# EAGLE schematic ADCS (EAGLE 9.6.0)

## Sheet 1 of 10: SMC
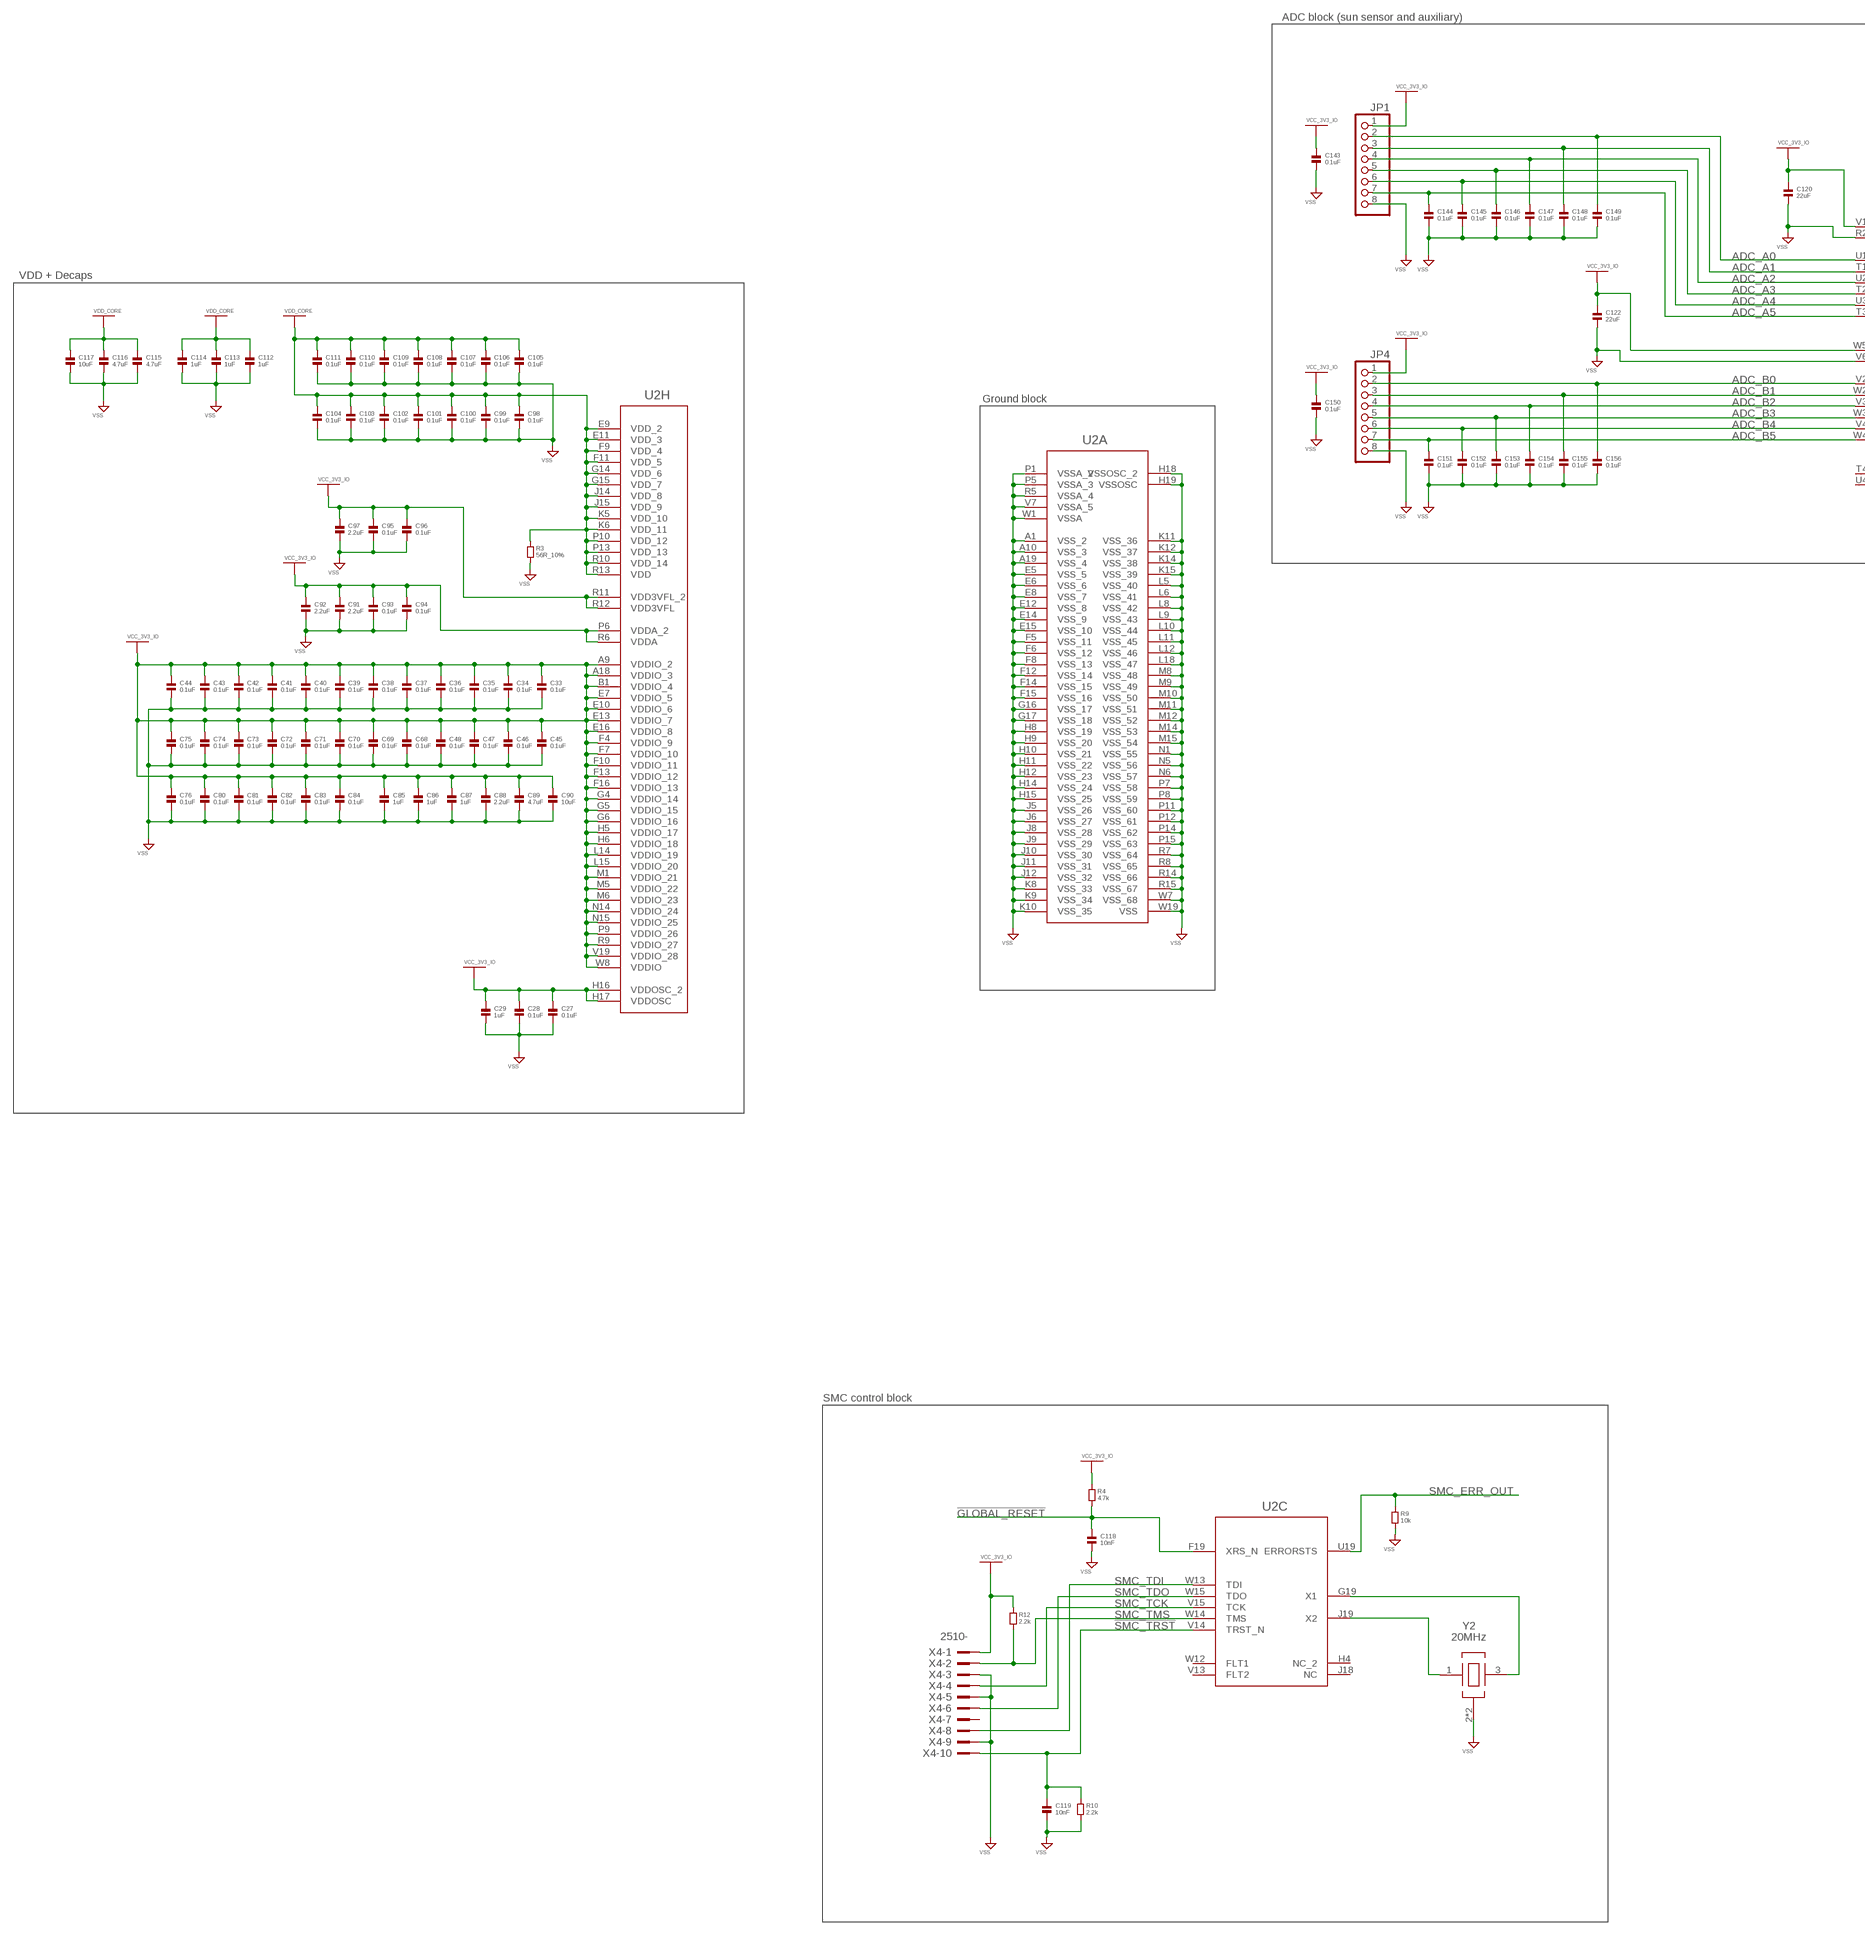
[diagram p0: schematic, sheet 1, part 1 of 2]
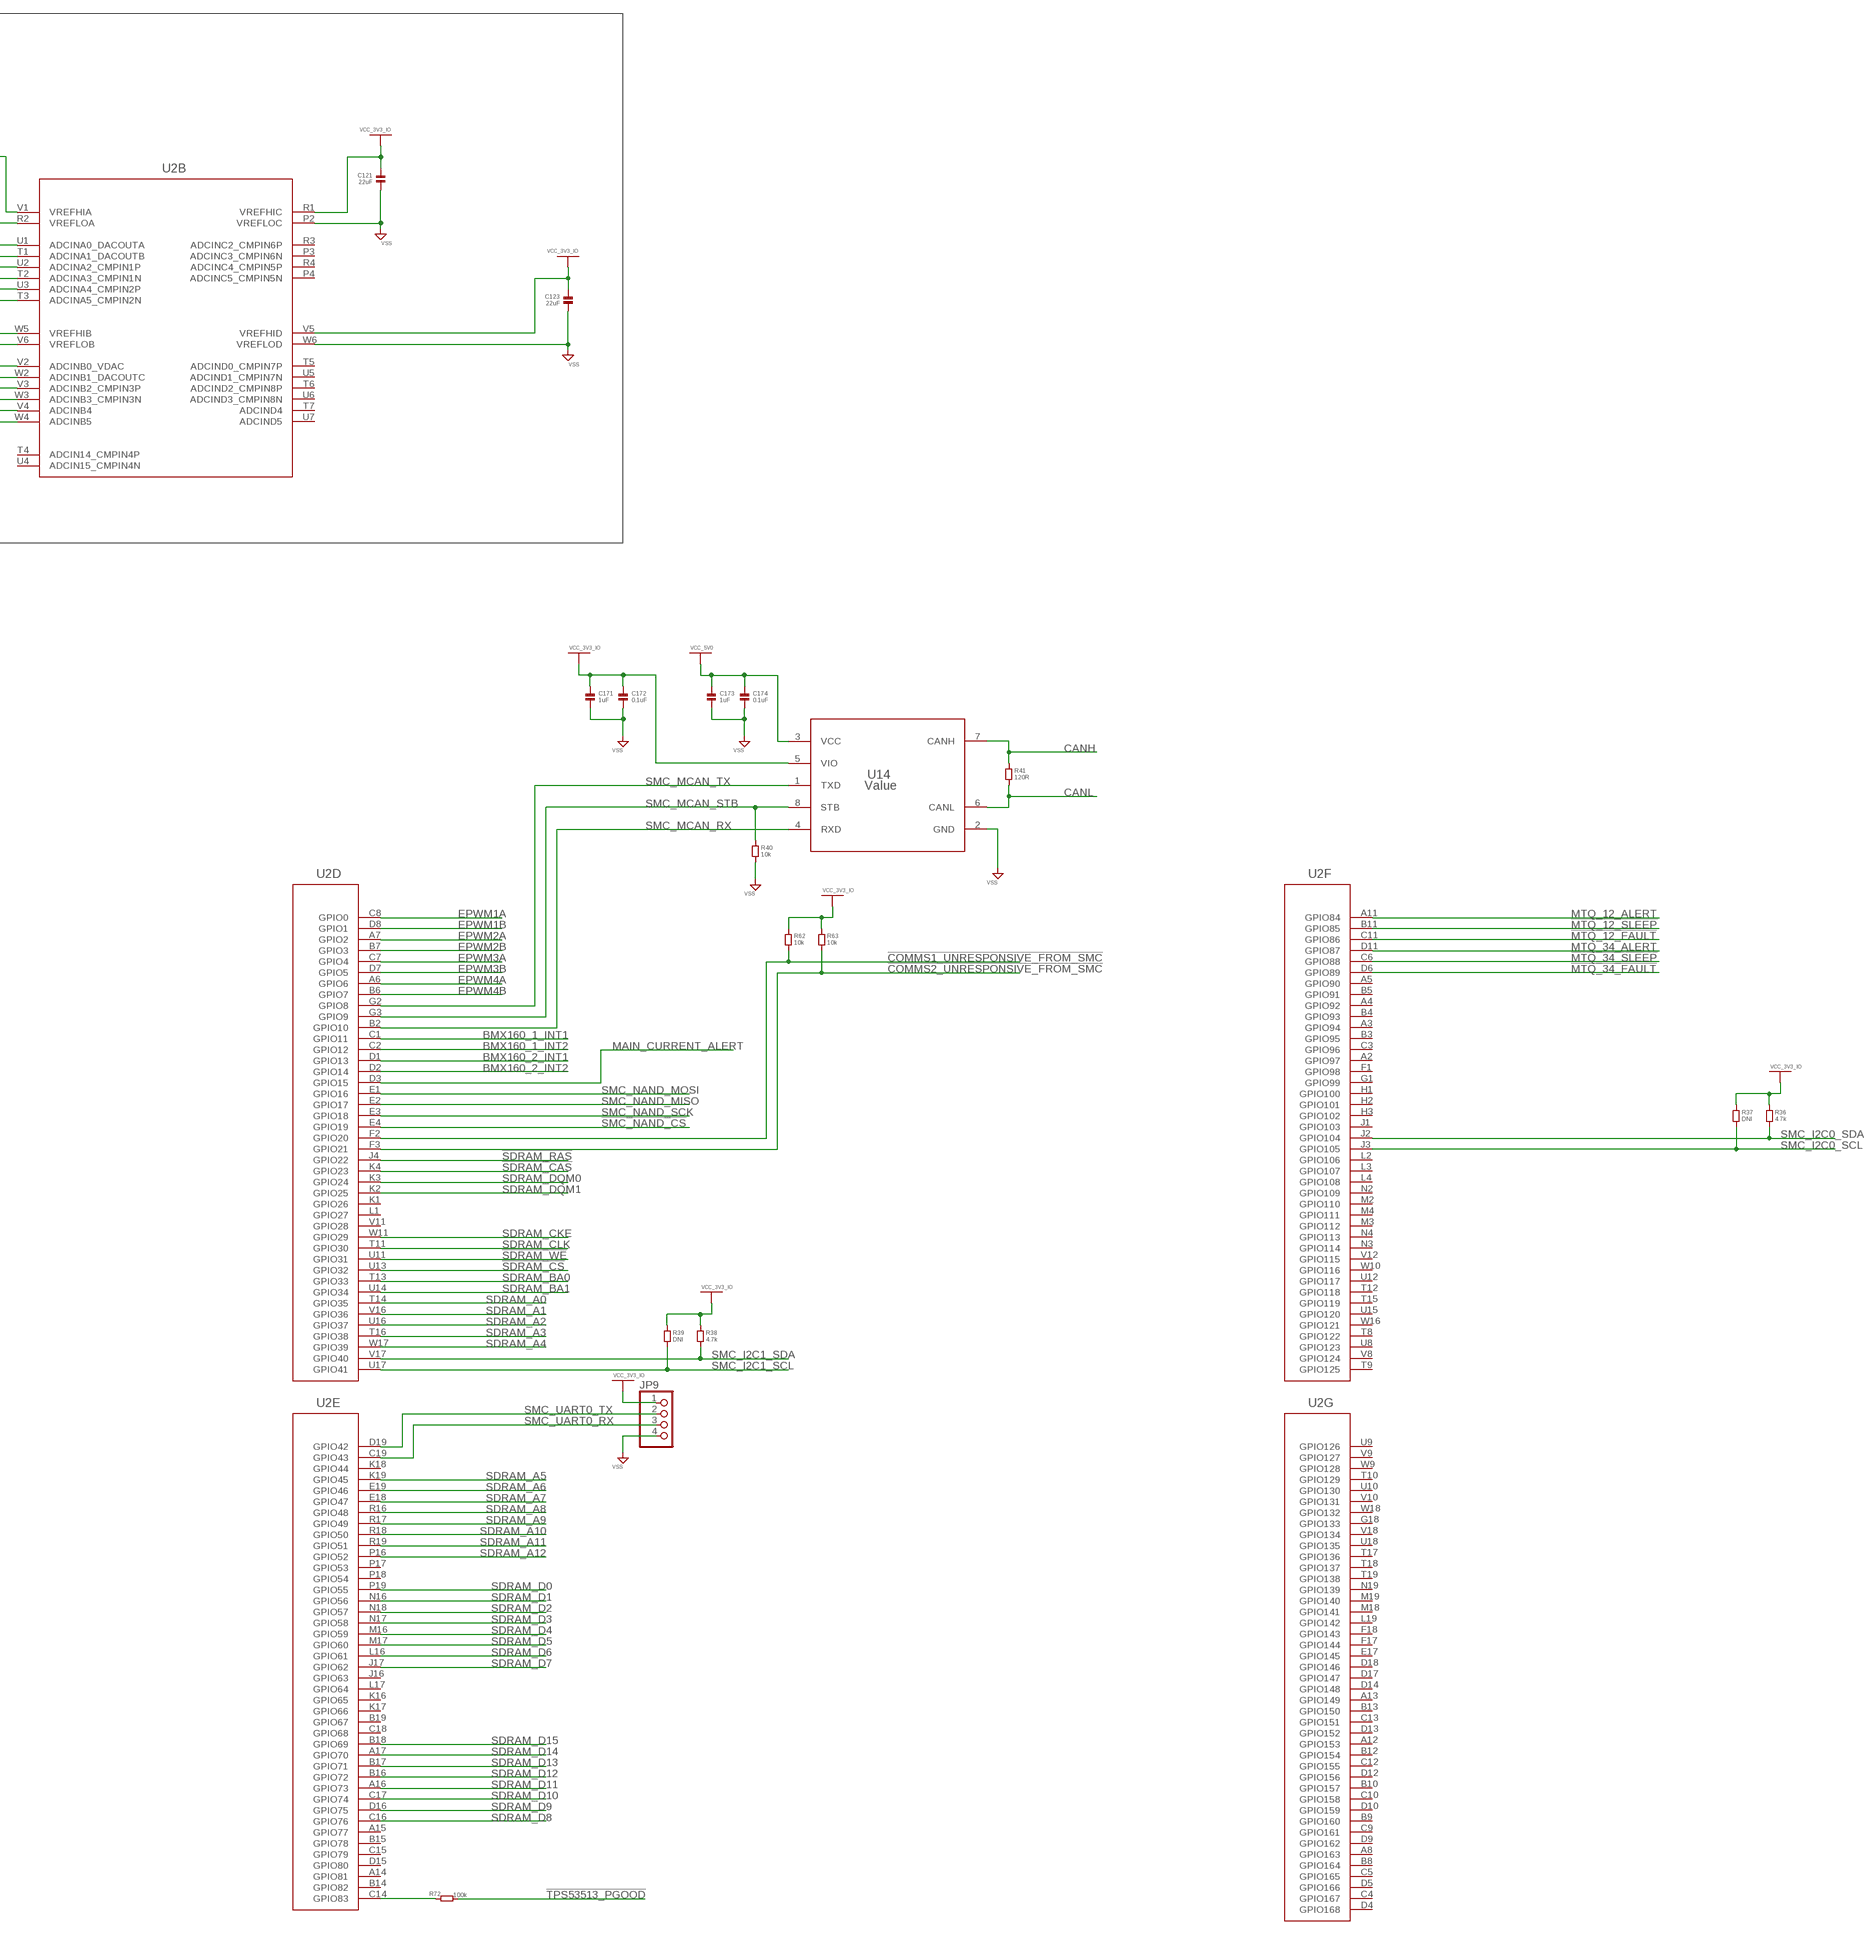
[diagram p1: schematic, sheet 1, part 2 of 2]

### Parts
C27  0.1uF  CAPACITOR.0402  [0402]
C28  0.1uF  CAPACITOR.0402  [0402]
C29  1uF  CAPACITOR.0402  [0402]
C33  0.1uF  CAPACITOR.0402  [0402]
C34  0.1uF  CAPACITOR.0402  [0402]
C35  0.1uF  CAPACITOR.0402  [0402]
C36  0.1uF  CAPACITOR.0402  [0402]
C37  0.1uF  CAPACITOR.0402  [0402]
C38  0.1uF  CAPACITOR.0402  [0402]
C39  0.1uF  CAPACITOR.0402  [0402]
C40  0.1uF  CAPACITOR.0402  [0402]
C41  0.1uF  CAPACITOR.0402  [0402]
C42  0.1uF  CAPACITOR.0402  [0402]
C43  0.1uF  CAPACITOR.0402  [0402]
C44  0.1uF  CAPACITOR.0402  [0402]
C45  0.1uF  CAPACITOR.0402  [0402]
C46  0.1uF  CAPACITOR.0402  [0402]
C47  0.1uF  CAPACITOR.0402  [0402]
C48  0.1uF  CAPACITOR.0402  [0402]
C68  0.1uF  CAPACITOR.0402  [0402]
C69  0.1uF  CAPACITOR.0402  [0402]
C70  0.1uF  CAPACITOR.0402  [0402]
C71  0.1uF  CAPACITOR.0402  [0402]
C72  0.1uF  CAPACITOR.0402  [0402]
C73  0.1uF  CAPACITOR.0402  [0402]
C74  0.1uF  CAPACITOR.0402  [0402]
C75  0.1uF  CAPACITOR.0402  [0402]
C76  0.1uF  CAPACITOR.0402  [0402]
C80  0.1uF  CAPACITOR.0402  [0402]
C81  0.1uF  CAPACITOR.0402  [0402]
C82  0.1uF  CAPACITOR.0402  [0402]
C83  0.1uF  CAPACITOR.0402  [0402]
C84  0.1uF  CAPACITOR.0402  [0402]
C85  1uF  CAPACITOR.0402  [0402]
C86  1uF  CAPACITOR.0402  [0402]
C87  1uF  CAPACITOR.0402  [0402]
C88  2.2uF  CAPACITOR.0402  [0402]
C89  4.7uF  CAPACITOR.0603  [0603]
C90  10uF  CAPACITOR.0603  [0603]
C91  2.2uF  CAPACITOR.0402  [0402]
C92  2.2uF  CAPACITOR.0402  [0402]
C93  0.1uF  CAPACITOR.0402  [0402]
C94  0.1uF  CAPACITOR.0402  [0402]
C95  0.1uF  CAPACITOR.0402  [0402]
C96  0.1uF  CAPACITOR.0402  [0402]
C97  2.2uF  CAPACITOR.0402  [0402]
C98  0.1uF  CAPACITOR.0402  [0402]
C99  0.1uF  CAPACITOR.0402  [0402]
C100  0.1uF  CAPACITOR.0402  [0402]
C101  0.1uF  CAPACITOR.0402  [0402]
C102  0.1uF  CAPACITOR.0402  [0402]
C103  0.1uF  CAPACITOR.0402  [0402]
C104  0.1uF  CAPACITOR.0402  [0402]
C105  0.1uF  CAPACITOR.0402  [0402]
C106  0.1uF  CAPACITOR.0402  [0402]
C107  0.1uF  CAPACITOR.0402  [0402]
C108  0.1uF  CAPACITOR.0402  [0402]
C109  0.1uF  CAPACITOR.0402  [0402]
C110  0.1uF  CAPACITOR.0402  [0402]
C111  0.1uF  CAPACITOR.0402  [0402]
C112  1uF  CAPACITOR.0402  [0402]
C113  1uF  CAPACITOR.0402  [0402]
C114  1uF  CAPACITOR.0402  [0402]
C115  4.7uF  CAPACITOR.0603  [0603]
C116  4.7uF  CAPACITOR.0603  [0603]
C117  10uF  CAPACITOR.0603  [0603]
C118  10nF  CAPACITOR.0603  [0603]
C119  10nF  CAPACITOR.0603  [0603]
C120  22uF  CAPACITOR.0603  [0603]
C121  22uF  CAPACITOR.0603  [0603]
C122  22uF  CAPACITOR.0603  [0603]
C123  22uF  CAPACITOR.0603  [0603]
C143  0.1uF  CAPACITOR.0603  [0603]
C144  0.1uF  CAPACITOR.0603  [0603]
C145  0.1uF  CAPACITOR.0603  [0603]
C146  0.1uF  CAPACITOR.0603  [0603]
C147  0.1uF  CAPACITOR.0603  [0603]
C148  0.1uF  CAPACITOR.0603  [0603]
C149  0.1uF  CAPACITOR.0603  [0603]
C150  0.1uF  CAPACITOR.0603  [0603]
C151  0.1uF  CAPACITOR.0603  [0603]
C152  0.1uF  CAPACITOR.0603  [0603]
C153  0.1uF  CAPACITOR.0603  [0603]
C154  0.1uF  CAPACITOR.0603  [0603]
C155  0.1uF  CAPACITOR.0603  [0603]
C156  0.1uF  CAPACITOR.0603  [0603]
C171  1uF  CAPACITOR.0603  [0603]
C172  0.1uF  CAPACITOR.0603  [0603]
C173  1uF  CAPACITOR.0603  [0603]
C174  0.1uF  CAPACITOR.0603  [0603]
JP1  PINHD-1X8  [1X08]
JP4  PINHD-1X8  [1X08]
JP9  PINHD-1X4  [1X04]
R3  56R_10%  RESISTOR.0402  [0402]
R4  4.7k  RESISTOR.0603  [0603]
R9  10k  RESISTOR.0603  [0603]
R10  2.2k  RESISTOR.0603  [0603]
R12  2.2k  RESISTOR.0603  [0603]
R36  4.7k  RESISTOR.0603  [0603]
R37  DNI  RESISTOR.0603  [0603]
R38  4.7k  RESISTOR.0603  [0603]
R39  DNI  RESISTOR.0603  [0603]
R40  10k  RESISTOR.0603  [0603]
R41  120R  RESISTOR.0603  [0603]
R62  10k  RESISTOR.0603  [0603]
R63  10k  RESISTOR.0603  [0603]
R72  100k  RESISTOR.0603  [0603]
U2  Value  TEXAS_INSTRUMENTS-MICROCONTROLLER-TMS320F28386DZWTQ  [ZWT0337A-IPC_A]
U14  Value  TEXAS_INSTRUMENTS-CAN_TRANSCEIVER-TCAN1042VDRQ1  [TEXAS_INSTRUMENTS-CAN_TRANSCEIVER-TCAN1042/LED_DRIVER-TLC59731DR]
X4  2510-  [PAK100/2500-10]
Y2  20MHz  ESC-OSCILLATOR-ECS_200_9_33B_CTP_TR  [ESC-OSCILLATOR-ECS_200_9_33B_CTP_TR]

### Nets
!COMMS1_UNRESPONSIVE_FROM_SMC: R62.2 U2.F2(D:GPIO20) ; also sheet 4
!COMMS2_UNRESPONSIVE_FROM_SMC: R63.2 U2.F3(D:GPIO21) ; also sheet 4
!GLOBAL_RESET: C118.1 R4.2 U2.F19(C:XRS_N) ; also sheet 4,6,7
!MTQ_12_FAULT: U2.C11(F:GPIO86) ; also sheet 3
!MTQ_12_SLEEP: U2.B11(F:GPIO85) ; also sheet 3
!MTQ_34_FAULT: U2.D6(F:GPIO89) ; also sheet 3
!MTQ_34_SLEEP: U2.C6(F:GPIO88) ; also sheet 3
!SDRAM_CAS: U2.K4(D:GPIO23) ; also sheet 2
!SDRAM_CS: U2.U13(D:GPIO32) ; also sheet 2
!SDRAM_RAS: U2.J4(D:GPIO22) ; also sheet 2
!SDRAM_WE: U2.U11(D:GPIO31) ; also sheet 2
!SMC_NAND_CS: U2.E4(D:GPIO19) ; also sheet 2
!SMC_TRST: C119.1 R10.1 U2.V14(C:TRST_N) X4.10
!TPS53513_PGOOD: R72.2 ; also sheet 4,9
ADC_A0: C149.1 JP1.2 U2.U1(B:ADCINA0_DACOUTA)
ADC_A1: C148.1 JP1.3 U2.T1(B:ADCINA1_DACOUTB)
ADC_A2: C147.1 JP1.4 U2.U2(B:ADCINA2_CMPIN1P)
ADC_A3: C146.1 JP1.5 U2.T2(B:ADCINA3_CMPIN1N)
ADC_A4: C145.1 JP1.6 U2.U3(B:ADCINA4_CMPIN2P)
ADC_A5: C144.1 JP1.7 U2.T3(B:ADCINA5_CMPIN2N)
ADC_B0: C156.1 JP4.2 U2.V2(B:ADCINB0_VDAC)
ADC_B1: C155.1 JP4.3 U2.W2(B:ADCINB1_DACOUTC)
ADC_B2: C154.1 JP4.4 U2.V3(B:ADCINB2_CMPIN3P)
ADC_B3: C153.1 JP4.5 U2.W3(B:ADCINB3_CMPIN3N)
ADC_B4: C152.1 JP4.6 U2.V4(B:ADCINB4)
ADC_B5: C151.1 JP4.7 U2.W4(B:ADCINB5)
BMX160_1_INT1: U2.C1(D:GPIO11) ; also sheet 5
BMX160_1_INT2: U2.C2(D:GPIO12) ; also sheet 5
BMX160_2_INT1: U2.D1(D:GPIO13) ; also sheet 5
BMX160_2_INT2: U2.D2(D:GPIO14) ; also sheet 5
CANH: R41.1 U14.7(CANH) ; also sheet 6,7,10
CANL: R41.2 U14.6(CANL) ; also sheet 6,7,10
EPWM1A: U2.C8(D:GPIO0) ; also sheet 3
EPWM1B: U2.D8(D:GPIO1) ; also sheet 3
EPWM2A: U2.A7(D:GPIO2) ; also sheet 3
EPWM2B: U2.B7(D:GPIO3) ; also sheet 3
EPWM3A: U2.C7(D:GPIO4) ; also sheet 3
EPWM3B: U2.D7(D:GPIO5) ; also sheet 3
EPWM4A: U2.A6(D:GPIO6) ; also sheet 3
EPWM4B: U2.B6(D:GPIO7) ; also sheet 3
MAIN_CURRENT_ALERT: U2.D3(D:GPIO15) ; also sheet 9
MTQ_12_ALERT: U2.A11(F:GPIO84) ; also sheet 3
MTQ_34_ALERT: U2.D11(F:GPIO87) ; also sheet 3
N$1: U2.J19(C:X2) Y2.1(XI)
N$8: U2.G19(C:X1) Y2.3(XO)
N$44: R72.1 U2.C14(E:GPIO83)
SDRAM_A0: U2.T14(D:GPIO35) ; also sheet 2
SDRAM_A1: U2.V16(D:GPIO36) ; also sheet 2
SDRAM_A2: U2.U16(D:GPIO37) ; also sheet 2
SDRAM_A3: U2.T16(D:GPIO38) ; also sheet 2
SDRAM_A4: U2.W17(D:GPIO39) ; also sheet 2
SDRAM_A5: U2.K19(E:GPIO45) ; also sheet 2
SDRAM_A6: U2.E19(E:GPIO46) ; also sheet 2
SDRAM_A7: U2.E18(E:GPIO47) ; also sheet 2
SDRAM_A8: U2.R16(E:GPIO48) ; also sheet 2
SDRAM_A9: U2.R17(E:GPIO49) ; also sheet 2
SDRAM_A10: U2.R18(E:GPIO50) ; also sheet 2
SDRAM_A11: U2.R19(E:GPIO51) ; also sheet 2
SDRAM_A12: U2.P16(E:GPIO52) ; also sheet 2
SDRAM_BA0: U2.T13(D:GPIO33) ; also sheet 2
SDRAM_BA1: U2.U14(D:GPIO34) ; also sheet 2
SDRAM_CKE: U2.W11(D:GPIO29) ; also sheet 2
SDRAM_CLK: U2.T11(D:GPIO30) ; also sheet 2
SDRAM_D0: U2.P19(E:GPIO55) ; also sheet 2
SDRAM_D1: U2.N16(E:GPIO56) ; also sheet 2
SDRAM_D2: U2.N18(E:GPIO57) ; also sheet 2
SDRAM_D3: U2.N17(E:GPIO58) ; also sheet 2
SDRAM_D4: U2.M16(E:GPIO59) ; also sheet 2
SDRAM_D5: U2.M17(E:GPIO60) ; also sheet 2
SDRAM_D6: U2.L16(E:GPIO61) ; also sheet 2
SDRAM_D7: U2.J17(E:GPIO62) ; also sheet 2
SDRAM_D8: U2.C16(E:GPIO76) ; also sheet 2
SDRAM_D9: U2.D16(E:GPIO75) ; also sheet 2
SDRAM_D10: U2.C17(E:GPIO74) ; also sheet 2
SDRAM_D11: U2.A16(E:GPIO73) ; also sheet 2
SDRAM_D12: U2.B16(E:GPIO72) ; also sheet 2
SDRAM_D13: U2.B17(E:GPIO71) ; also sheet 2
SDRAM_D14: U2.A17(E:GPIO70) ; also sheet 2
SDRAM_D15: U2.B18(E:GPIO69) ; also sheet 2
SDRAM_DQM0: U2.K3(D:GPIO24) ; also sheet 2
SDRAM_DQM1: U2.K2(D:GPIO25) ; also sheet 2
SMC_ERR_OUT: R9.1 U2.U19(C:ERRORSTS) ; also sheet 4
SMC_I2C0_SCL: R37.2 U2.J3(F:GPIO105) ; also sheet 3,5,9,10
SMC_I2C0_SDA: R36.2 U2.J2(F:GPIO104) ; also sheet 3,5,9,10
SMC_I2C1_SCL: R39.2 U2.U17(D:GPIO41) ; also sheet 10
SMC_I2C1_SDA: R38.2 U2.V17(D:GPIO40) ; also sheet 10
SMC_MCAN_RX: U2.B2(D:GPIO10) U14.4(RXD)
SMC_MCAN_STB: R40.1 U2.G3(D:GPIO9) U14.8(STB)
SMC_MCAN_TX: U2.G2(D:GPIO8) U14.1(TXD)
SMC_NAND_MISO: U2.E2(D:GPIO17) ; also sheet 2
SMC_NAND_MOSI: U2.E1(D:GPIO16) ; also sheet 2
SMC_NAND_SCK: U2.E3(D:GPIO18) ; also sheet 2
SMC_TCK: U2.V15(C:TCK) X4.4
SMC_TDI: U2.W13(C:TDI) X4.8
SMC_TDO: U2.W15(C:TDO) X4.6
SMC_TMS: R12.2 U2.W14(C:TMS) X4.2
SMC_UART0_RX: JP9.3 U2.C19(E:GPIO43) ; also sheet 10
SMC_UART0_TX: JP9.2 U2.D19(E:GPIO42) ; also sheet 10
VCC_3V3_IO: C27.1 C28.1 C29.1 C33.1 C34.1 C35.1 C36.1 C37.1 C38.1 C39.1 C40.1 C41.1 C42.1 C43.1 C44.1 C45.1 C46.1 C47.1 C48.1 C68.1 C69.1 C70.1 C71.1 C72.1 C73.1 C74.1 C75.1 C76.1 C80.1 C81.1 C82.1 C83.1 C84.1 C85.1 C86.1 C87.1 C88.1 C89.1 C90.1 C91.1 C92.1 C93.1 C94.1 C95.1 C96.1 C97.1 C120.1 C121.1 C122.1 C123.1 C143.1 C150.1 C171.1 C172.1 JP1.1 JP4.1 JP9.1 R4.1 R12.1 R36.1 R37.1 R38.1 R39.1 R62.1 R63.1 U2.A9(H:VDDIO_2) U2.A18(H:VDDIO_3) U2.B1(H:VDDIO_4) U2.E7(H:VDDIO_5) U2.E10(H:VDDIO_6) U2.E13(H:VDDIO_7) U2.E16(H:VDDIO_8) U2.F4(H:VDDIO_9) U2.F7(H:VDDIO_10) U2.F10(H:VDDIO_11) U2.F13(H:VDDIO_12) U2.F16(H:VDDIO_13) U2.G4(H:VDDIO_14) U2.G5(H:VDDIO_15) U2.G6(H:VDDIO_16) U2.H5(H:VDDIO_17) U2.H6(H:VDDIO_18) U2.H16(H:VDDOSC_2) U2.H17(H:VDDOSC) U2.L14(H:VDDIO_19) U2.L15(H:VDDIO_20) U2.M1(H:VDDIO_21) U2.M5(H:VDDIO_22) U2.M6(H:VDDIO_23) U2.N14(H:VDDIO_24) U2.N15(H:VDDIO_25) U2.P6(H:VDDA_2) U2.P9(H:VDDIO_26) U2.R1(B:VREFHIC) U2.R6(H:VDDA) U2.R9(H:VDDIO_27) U2.R11(H:VDD3VFL_2) U2.R12(H:VDD3VFL) U2.V1(B:VREFHIA) U2.V5(B:VREFHID) U2.V19(H:VDDIO_28) U2.W5(B:VREFHIB) U2.W8(H:VDDIO) U14.5(VIO) X4.1 ; also sheet 2,3,4,5,6,7,8,9,10
VCC_5V0: C173.1 C174.1 U14.3(VCC) ; also sheet 3,6,7,9,10
VDD_CORE: C98.1 C99.1 C100.1 C101.1 C102.1 C103.1 C104.1 C105.1 C106.1 C107.1 C108.1 C109.1 C110.1 C111.1 C112.1 C113.1 C114.1 C115.1 C116.1 C117.1 R3.1 U2.E9(H:VDD_2) U2.E11(H:VDD_3) U2.F9(H:VDD_4) U2.F11(H:VDD_5) U2.G14(H:VDD_6) U2.G15(H:VDD_7) U2.J14(H:VDD_8) U2.J15(H:VDD_9) U2.K5(H:VDD_10) U2.K6(H:VDD_11) U2.P10(H:VDD_12) U2.P13(H:VDD_13) U2.R10(H:VDD_14) U2.R13(H:VDD)
VSS: C27.2 C28.2 C29.2 C33.2 C34.2 C35.2 C36.2 C37.2 C38.2 C39.2 C40.2 C41.2 C42.2 C43.2 C44.2 C45.2 C46.2 C47.2 C48.2 C68.2 C69.2 C70.2 C71.2 C72.2 C73.2 C74.2 C75.2 C76.2 C80.2 C81.2 C82.2 C83.2 C84.2 C85.2 C86.2 C87.2 C88.2 C89.2 C90.2 C91.2 C92.2 C93.2 C94.2 C95.2 C96.2 C97.2 C98.2 C99.2 C100.2 C101.2 C102.2 C103.2 C104.2 C105.2 C106.2 C107.2 C108.2 C109.2 C110.2 C111.2 C112.2 C113.2 C114.2 C115.2 C116.2 C117.2 C118.2 C119.2 C120.2 C121.2 C122.2 C123.2 C143.2 C144.2 C145.2 C146.2 C147.2 C148.2 C149.2 C150.2 C151.2 C152.2 C153.2 C154.2 C155.2 C156.2 C171.2 C172.2 C173.2 C174.2 JP1.8 JP4.8 JP9.4 R3.2 R9.2 R10.2 R40.2 U2.A1(A:VSS_2) U2.A10(A:VSS_3) U2.A19(A:VSS_4) U2.E5(A:VSS_5) U2.E6(A:VSS_6) U2.E8(A:VSS_7) U2.E12(A:VSS_8) U2.E14(A:VSS_9) U2.E15(A:VSS_10) U2.F5(A:VSS_11) U2.F6(A:VSS_12) U2.F8(A:VSS_13) U2.F12(A:VSS_14) U2.F14(A:VSS_15) U2.F15(A:VSS_16) U2.G16(A:VSS_17) U2.G17(A:VSS_18) U2.H8(A:VSS_19) U2.H9(A:VSS_20) U2.H10(A:VSS_21) U2.H11(A:VSS_22) U2.H12(A:VSS_23) U2.H14(A:VSS_24) U2.H15(A:VSS_25) U2.H18(A:VSSOSC_2) U2.H19(A:VSSOSC) U2.J5(A:VSS_26) U2.J6(A:VSS_27) U2.J8(A:VSS_28) U2.J9(A:VSS_29) U2.J10(A:VSS_30) U2.J11(A:VSS_31) U2.J12(A:VSS_32) U2.K8(A:VSS_33) U2.K9(A:VSS_34) U2.K10(A:VSS_35) U2.K11(A:VSS_36) U2.K12(A:VSS_37) U2.K14(A:VSS_38) U2.K15(A:VSS_39) U2.L5(A:VSS_40) U2.L6(A:VSS_41) U2.L8(A:VSS_42) U2.L9(A:VSS_43) U2.L10(A:VSS_44) U2.L11(A:VSS_45) U2.L12(A:VSS_46) U2.L18(A:VSS_47) U2.M8(A:VSS_48) U2.M9(A:VSS_49) U2.M10(A:VSS_50) U2.M11(A:VSS_51) U2.M12(A:VSS_52) U2.M14(A:VSS_53) U2.M15(A:VSS_54) U2.N1(A:VSS_55) U2.N5(A:VSS_56) U2.N6(A:VSS_57) U2.P1(A:VSSA_2) U2.P2(B:VREFLOC) U2.P5(A:VSSA_3) U2.P7(A:VSS_58) U2.P8(A:VSS_59) U2.P11(A:VSS_60) U2.P12(A:VSS_61) U2.P14(A:VSS_62) U2.P15(A:VSS_63) U2.R2(B:VREFLOA) U2.R5(A:VSSA_4) U2.R7(A:VSS_64) U2.R8(A:VSS_65) U2.R14(A:VSS_66) U2.R15(A:VSS_67) U2.V6(B:VREFLOB) U2.V7(A:VSSA_5) U2.W1(A:VSSA) U2.W6(B:VREFLOD) U2.W7(A:VSS_68) U2.W19(A:VSS) U14.2(GND) X4.3 X4.5 X4.9 Y2.2(VSS) Y2.4(VSS) ; also sheet 2,3,4,5,6,7,8,9,10
Unconnected: U2.A2(F:GPIO97) U2.A3(F:GPIO94) U2.A4(F:GPIO92) U2.A5(F:GPIO90) U2.A8(G:GPIO163) U2.A12(G:GPIO153) U2.A13(G:GPIO149) U2.A14(E:GPIO81) U2.A15(E:GPIO77) U2.B3(F:GPIO95) U2.B4(F:GPIO93) U2.B5(F:GPIO91) U2.B8(G:GPIO164) U2.B9(G:GPIO160) U2.B10(G:GPIO157) U2.B12(G:GPIO154) U2.B13(G:GPIO150) U2.B14(E:GPIO82) U2.B15(E:GPIO78) U2.B19(E:GPIO67) U2.C3(F:GPIO96) U2.C4(G:GPIO167) U2.C5(G:GPIO165) U2.C9(G:GPIO161) U2.C10(G:GPIO158) U2.C12(G:GPIO155) U2.C13(G:GPIO151) U2.C15(E:GPIO79) U2.C18(E:GPIO68) U2.D4(G:GPIO168) U2.D5(G:GPIO166) U2.D9(G:GPIO162) U2.D10(G:GPIO159) U2.D12(G:GPIO156) U2.D13(G:GPIO152) U2.D14(G:GPIO148) U2.D15(E:GPIO80) U2.D17(G:GPIO147) U2.D18(G:GPIO146) U2.E17(G:GPIO145) U2.F1(F:GPIO98) U2.F17(G:GPIO144) U2.F18(G:GPIO143) U2.G1(F:GPIO99) U2.G18(G:GPIO133) U2.H1(F:GPIO100) U2.H2(F:GPIO101) U2.H3(F:GPIO102) U2.H4(C:NC_2) U2.J1(F:GPIO103) U2.J16(E:GPIO63) U2.J18(C:NC) U2.K1(D:GPIO26) U2.K16(E:GPIO65) U2.K17(E:GPIO66) U2.K18(E:GPIO44) U2.L1(D:GPIO27) U2.L2(F:GPIO106) U2.L3(F:GPIO107) U2.L4(F:GPIO108) U2.L17(E:GPIO64) U2.L19(G:GPIO142) U2.M2(F:GPIO110) U2.M3(F:GPIO112) U2.M4(F:GPIO111) U2.M18(G:GPIO141) U2.M19(G:GPIO140) U2.N2(F:GPIO109) U2.N3(F:GPIO114) U2.N4(F:GPIO113) U2.N19(G:GPIO139) U2.P3(B:ADCINC3_CMPIN6N) U2.P4(B:ADCINC5_CMPIN5N) U2.P17(E:GPIO53) U2.P18(E:GPIO54) U2.R3(B:ADCINC2_CMPIN6P) U2.R4(B:ADCINC4_CMPIN5P) U2.T4(B:ADCIN14_CMPIN4P) U2.T5(B:ADCIND0_CMPIN7P) U2.T6(B:ADCIND2_CMPIN8P) U2.T7(B:ADCIND4) U2.T8(F:GPIO122) U2.T9(F:GPIO125) U2.T10(G:GPIO129) U2.T12(F:GPIO118) U2.T15(F:GPIO119) U2.T17(G:GPIO136) U2.T18(G:GPIO137) U2.T19(G:GPIO138) U2.U4(B:ADCIN15_CMPIN4N) U2.U5(B:ADCIND1_CMPIN7N) U2.U6(B:ADCIND3_CMPIN8N) U2.U7(B:ADCIND5) U2.U8(F:GPIO123) U2.U9(G:GPIO126) U2.U10(G:GPIO130) U2.U12(F:GPIO117) U2.U15(F:GPIO120) U2.U18(G:GPIO135) U2.V8(F:GPIO124) U2.V9(G:GPIO127) U2.V10(G:GPIO131) U2.V11(D:GPIO28) U2.V12(F:GPIO115) U2.V13(C:FLT2) U2.V18(G:GPIO134) U2.W9(G:GPIO128) U2.W10(F:GPIO116) U2.W12(C:FLT1) U2.W16(F:GPIO121) U2.W18(G:GPIO132) X4.7

### Notes on the sheet
- ADC block (sun sensor and auxiliary)
- VDD + Decaps
- Ground block
- SMC control block

## Sheet 2 of 10: SMC DRAM + NAND flash
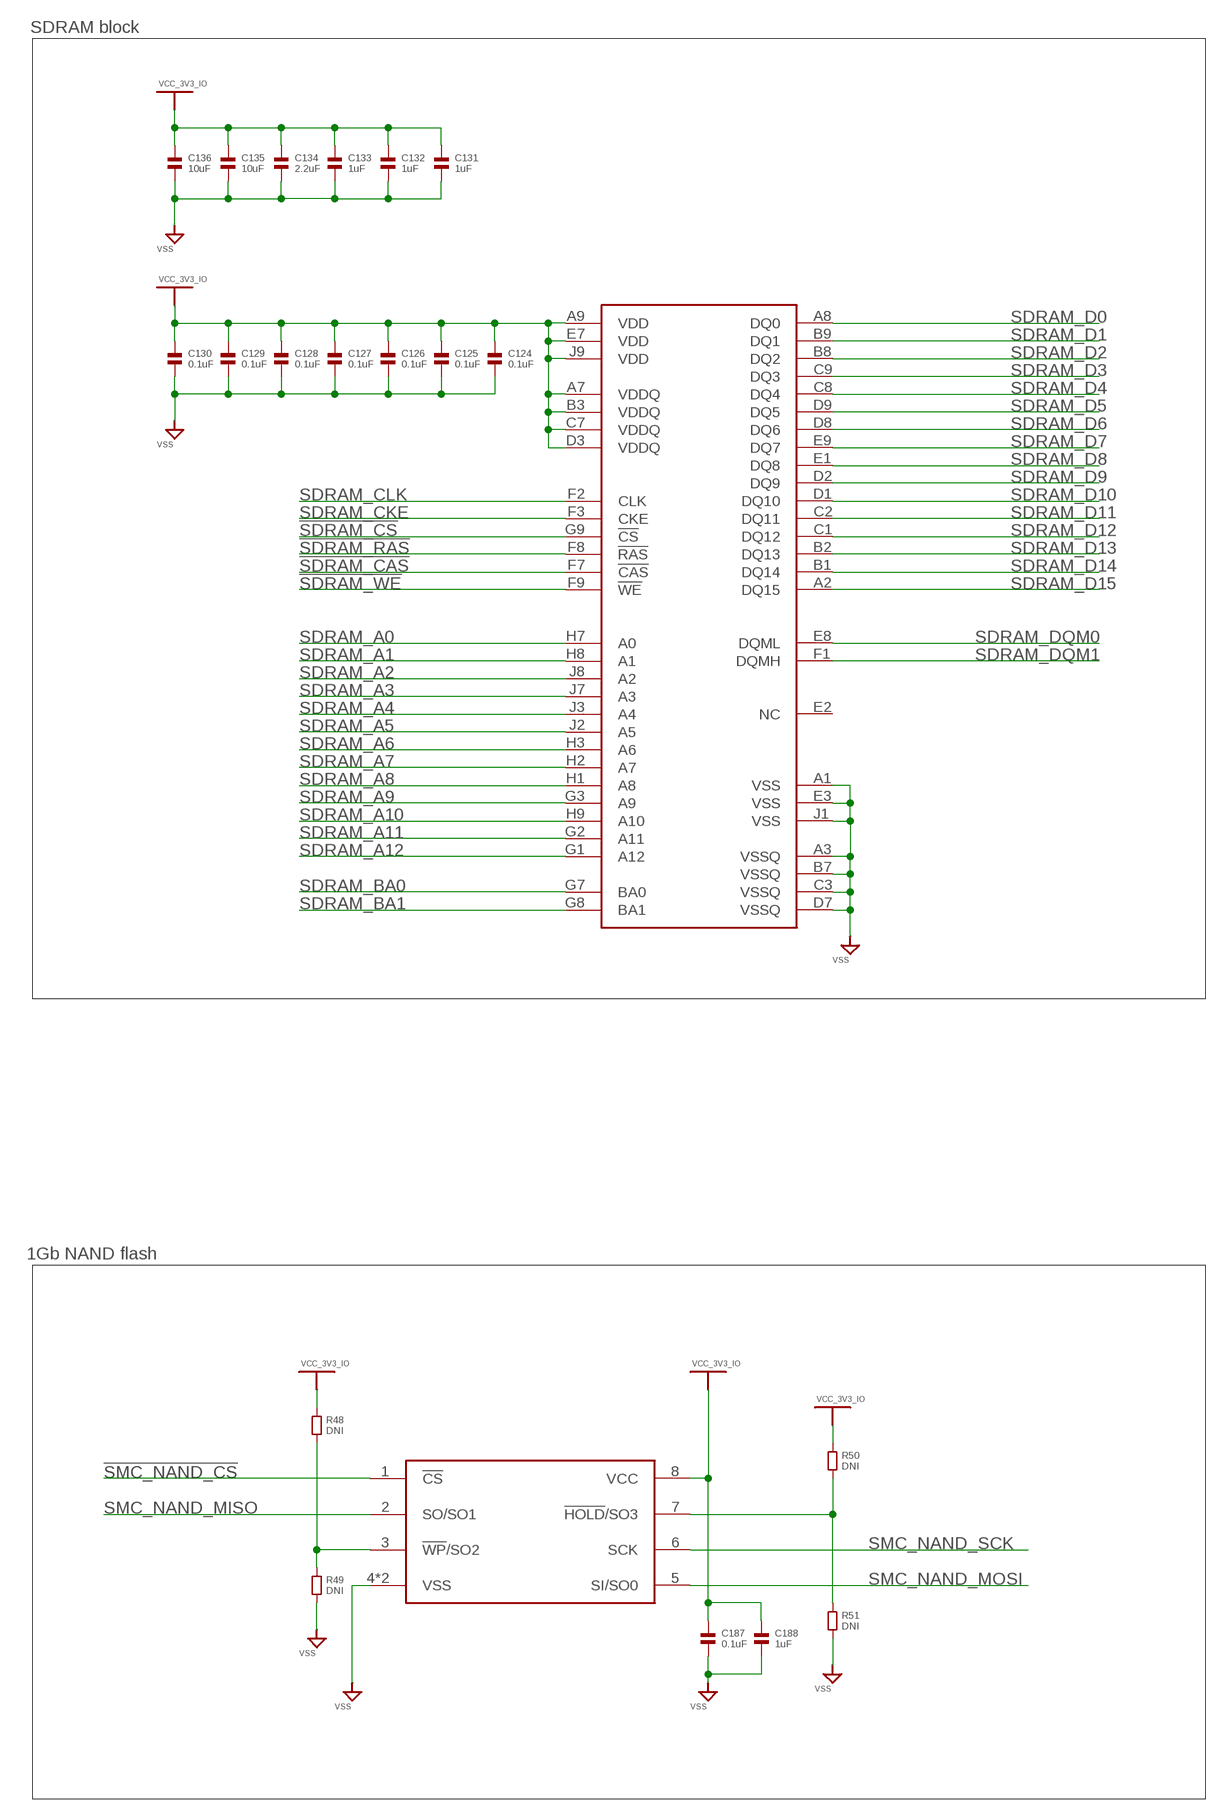
[diagram p2: schematic, sheet 2]

### Parts
C124  0.1uF  CAPACITOR.0603  [0603]
C125  0.1uF  CAPACITOR.0603  [0603]
C126  0.1uF  CAPACITOR.0603  [0603]
C127  0.1uF  CAPACITOR.0603  [0603]
C128  0.1uF  CAPACITOR.0603  [0603]
C129  0.1uF  CAPACITOR.0603  [0603]
C130  0.1uF  CAPACITOR.0603  [0603]
C131  1uF  CAPACITOR.0603  [0603]
C132  1uF  CAPACITOR.0603  [0603]
C133  1uF  CAPACITOR.0603  [0603]
C134  2.2uF  CAPACITOR.0603  [0603]
C135  10uF  CAPACITOR.0603  [0603]
C136  10uF  CAPACITOR.0603  [0603]
C187  0.1uF  CAPACITOR.0603  [0603]
C188  1uF  CAPACITOR.0603  [0603]
R48  DNI  RESISTOR.0603  [0603]
R49  DNI  RESISTOR.0603  [0603]
R50  DNI  RESISTOR.0603  [0603]
R51  DNI  RESISTOR.0603  [0603]
U6  ISSI-DRAM-IS42S16320F-7TL  [ISSI-DRAM-IS42S16320F-7TL]
U16  KIOXIA_AMERICA-NAND_FLASH-TC58CVG0S3HRAIG  [KIOXIA_AMERICA-NAND_FLASH-TC58CVG0S3HRAIG]

### Nets
!SDRAM_CAS: U6.F7(!CAS) ; also sheet 1
!SDRAM_CS: U6.G9(!CS) ; also sheet 1
!SDRAM_RAS: U6.F8(!RAS) ; also sheet 1
!SDRAM_WE: U6.F9(!WE) ; also sheet 1
!SMC_NAND_CS: U16.1(!CS) ; also sheet 1
N$37: R48.2 R49.1 U16.3(!WP!/SO2)
N$39: R50.2 R51.1 U16.7(!HOLD!/SO3)
SDRAM_A0: U6.H7(A0) ; also sheet 1
SDRAM_A1: U6.H8(A1) ; also sheet 1
SDRAM_A2: U6.J8(A2) ; also sheet 1
SDRAM_A3: U6.J7(A3) ; also sheet 1
SDRAM_A4: U6.J3(A4) ; also sheet 1
SDRAM_A5: U6.J2(A5) ; also sheet 1
SDRAM_A6: U6.H3(A6) ; also sheet 1
SDRAM_A7: U6.H2(A7) ; also sheet 1
SDRAM_A8: U6.H1(A8) ; also sheet 1
SDRAM_A9: U6.G3(A9) ; also sheet 1
SDRAM_A10: U6.H9(A10) ; also sheet 1
SDRAM_A11: U6.G2(A11) ; also sheet 1
SDRAM_A12: U6.G1(A12) ; also sheet 1
SDRAM_BA0: U6.G7(BA0) ; also sheet 1
SDRAM_BA1: U6.G8(BA1) ; also sheet 1
SDRAM_CKE: U6.F3(CKE) ; also sheet 1
SDRAM_CLK: U6.F2(CLK) ; also sheet 1
SDRAM_D0: U6.A8(DQ0) ; also sheet 1
SDRAM_D1: U6.B9(DQ1) ; also sheet 1
SDRAM_D2: U6.B8(DQ2) ; also sheet 1
SDRAM_D3: U6.C9(DQ3) ; also sheet 1
SDRAM_D4: U6.C8(DQ4) ; also sheet 1
SDRAM_D5: U6.D9(DQ5) ; also sheet 1
SDRAM_D6: U6.D8(DQ6) ; also sheet 1
SDRAM_D7: U6.E9(DQ7) ; also sheet 1
SDRAM_D8: U6.E1(DQ8) ; also sheet 1
SDRAM_D9: U6.D2(DQ9) ; also sheet 1
SDRAM_D10: U6.D1(DQ10) ; also sheet 1
SDRAM_D11: U6.C2(DQ11) ; also sheet 1
SDRAM_D12: U6.C1(DQ12) ; also sheet 1
SDRAM_D13: U6.B2(DQ13) ; also sheet 1
SDRAM_D14: U6.B1(DQ14) ; also sheet 1
SDRAM_D15: U6.A2(DQ15) ; also sheet 1
SDRAM_DQM0: U6.E8(DQML) ; also sheet 1
SDRAM_DQM1: U6.F1(DQMH) ; also sheet 1
SMC_NAND_MISO: U16.2(SO/SO1) ; also sheet 1
SMC_NAND_MOSI: U16.5(SI/SO0) ; also sheet 1
SMC_NAND_SCK: U16.6(SCK) ; also sheet 1
VCC_3V3_IO: C124.1 C125.1 C126.1 C127.1 C128.1 C129.1 C130.1 C131.1 C132.1 C133.1 C134.1 C135.1 C136.1 C187.1 C188.1 R48.1 R50.1 U6.A7(VDDQ) U6.A9(VDD) U6.B3(VDDQ) U6.C7(VDDQ) U6.D3(VDDQ) U6.E7(VDD) U6.J9(VDD) U16.8(VCC) ; also sheet 1,3,4,5,6,7,8,9,10
VSS: C124.2 C125.2 C126.2 C127.2 C128.2 C129.2 C130.2 C131.2 C132.2 C133.2 C134.2 C135.2 C136.2 C187.2 C188.2 R49.2 R51.2 U6.A1(VSS) U6.A3(VSSQ) U6.B7(VSSQ) U6.C3(VSSQ) U6.D7(VSSQ) U6.E3(VSS) U6.J1(VSS) U16.4(VSS) U16.9(VSS) ; also sheet 1,3,4,5,6,7,8,9,10
Unconnected: U6.E2(NC)

### Notes on the sheet
- SDRAM block
- 1Gb NAND flash

## Sheet 3 of 10: Magnetorquer PWM Drivers
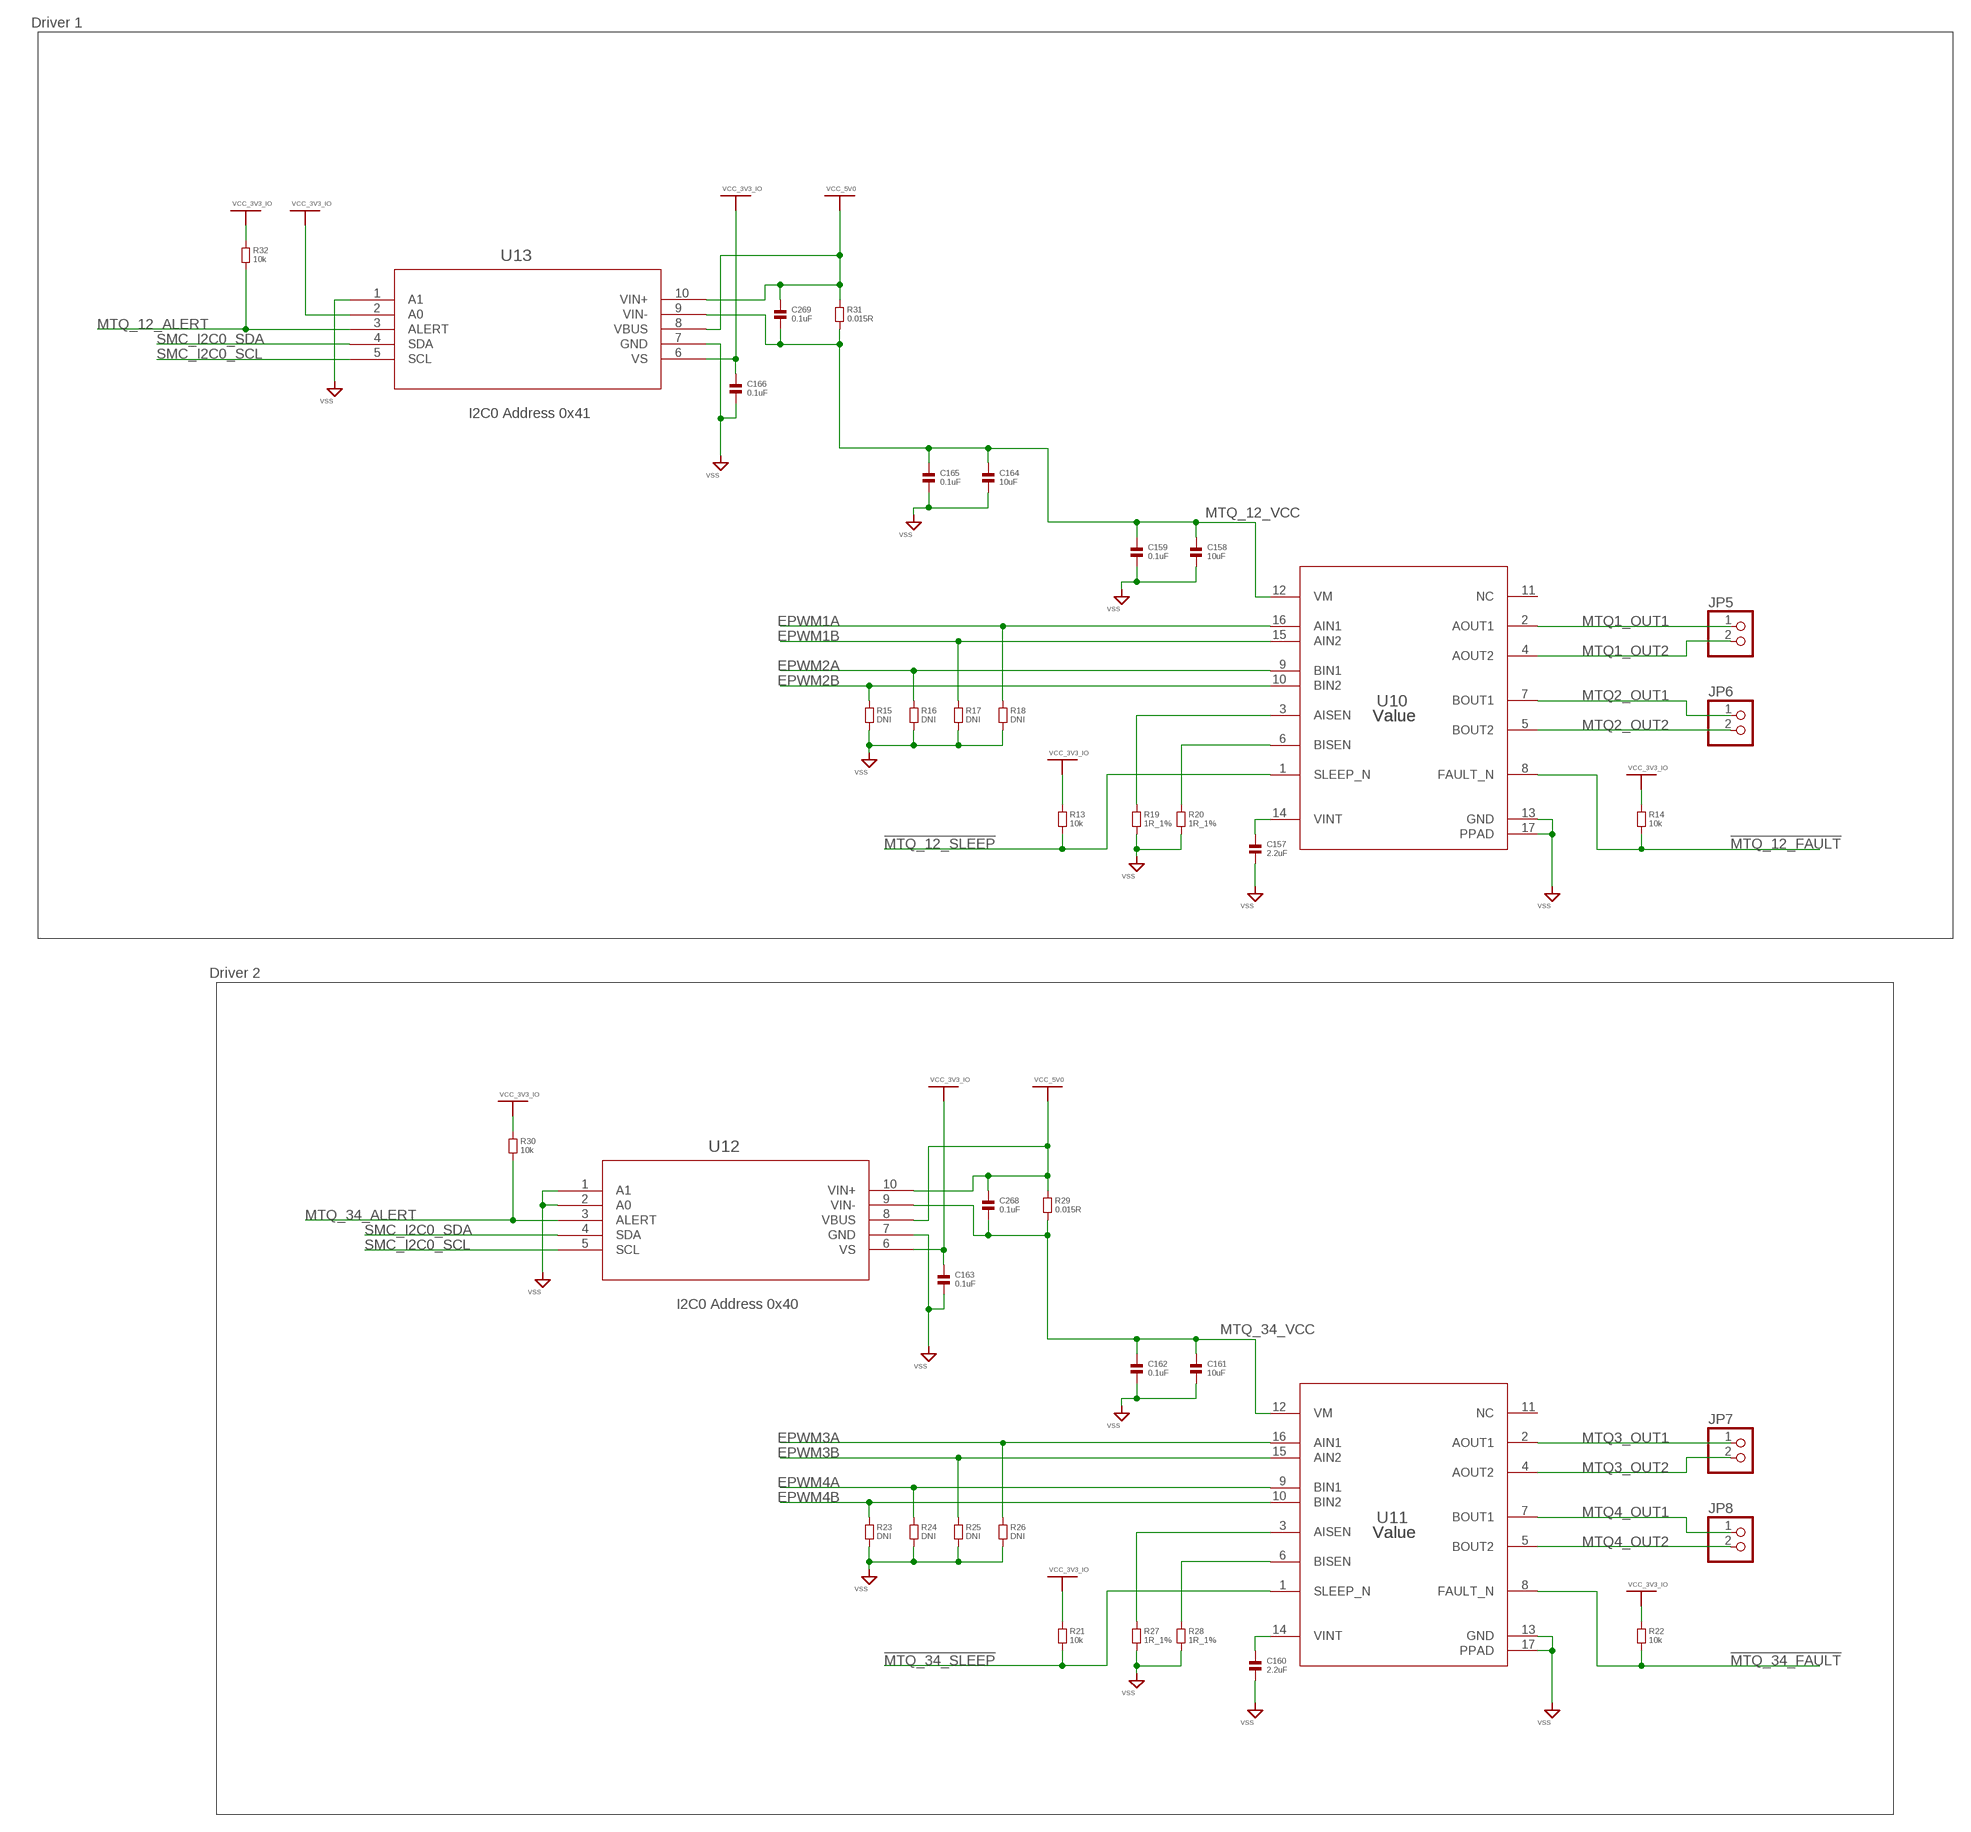
[diagram p3: schematic, sheet 3]

### Parts
C157  2.2uF  CAPACITOR.0603  [0603]
C158  10uF  CAPACITOR.0805  [0805]
C159  0.1uF  CAPACITOR.0603  [0603]
C160  2.2uF  CAPACITOR.0603  [0603]
C161  10uF  CAPACITOR.0805  [0805]
C162  0.1uF  CAPACITOR.0603  [0603]
C163  0.1uF  CAPACITOR.0603  [0603]
C164  10uF  CAPACITOR.0805  [0805]
C165  0.1uF  CAPACITOR.0603  [0603]
C166  0.1uF  CAPACITOR.0603  [0603]
C268  0.1uF  CAPACITOR.0603  [0603]
C269  0.1uF  CAPACITOR.0603  [0603]
JP5  PINHD-1X2  [1X02]
JP6  PINHD-1X2  [1X02]
JP7  PINHD-1X2  [1X02]
JP8  PINHD-1X2  [1X02]
R13  10k  RESISTOR.0603  [0603]
R14  10k  RESISTOR.0603  [0603]
R15  DNI  RESISTOR.0603  [0603]
R16  DNI  RESISTOR.0603  [0603]
R17  DNI  RESISTOR.0603  [0603]
R18  DNI  RESISTOR.0603  [0603]
R19  1R_1%  RESISTOR.0603  [0603]
R20  1R_1%  RESISTOR.0603  [0603]
R21  10k  RESISTOR.0603  [0603]
R22  10k  RESISTOR.0603  [0603]
R23  DNI  RESISTOR.0603  [0603]
R24  DNI  RESISTOR.0603  [0603]
R25  DNI  RESISTOR.0603  [0603]
R26  DNI  RESISTOR.0603  [0603]
R27  1R_1%  RESISTOR.0603  [0603]
R28  1R_1%  RESISTOR.0603  [0603]
R29  0.015R  RESISTOR.1206  [1206]
R30  10k  RESISTOR.0603  [0603]
R31  0.015R  RESISTOR.1206  [1206]
R32  10k  RESISTOR.0603  [0603]
U10  Value  TEXAS_INSTRUMENTS-MOTOR_PWM_DRIVER-DRV8833CPWP  [PWP0016K_N]
U11  Value  TEXAS_INSTRUMENTS-MOTOR_PWM_DRIVER-DRV8833CPWP  [PWP0016K_N]
U12  TEXAS_INSTRUMENTS-CURRENT_MONITOR-INA226_DGS_10  [TEXAS_INSTRUMENTS-CURRENT_MONITOR-INA226_DGS_10]
U13  TEXAS_INSTRUMENTS-CURRENT_MONITOR-INA226_DGS_10  [TEXAS_INSTRUMENTS-CURRENT_MONITOR-INA226_DGS_10]

### Nets
!MTQ_12_FAULT: R14.2 U10.8(FAULT_N) ; also sheet 1
!MTQ_12_SLEEP: R13.2 U10.1(SLEEP_N) ; also sheet 1
!MTQ_34_FAULT: R22.2 U11.8(FAULT_N) ; also sheet 1
!MTQ_34_SLEEP: R21.2 U11.1(SLEEP_N) ; also sheet 1
EPWM1A: R18.1 U10.16(AIN1) ; also sheet 1
EPWM1B: R17.1 U10.15(AIN2) ; also sheet 1
EPWM2A: R16.1 U10.9(BIN1) ; also sheet 1
EPWM2B: R15.1 U10.10(BIN2) ; also sheet 1
EPWM3A: R26.1 U11.16(AIN1) ; also sheet 1
EPWM3B: R25.1 U11.15(AIN2) ; also sheet 1
EPWM4A: R24.1 U11.9(BIN1) ; also sheet 1
EPWM4B: R23.1 U11.10(BIN2) ; also sheet 1
MTQ1_OUT1: JP5.1 U10.2(AOUT1)
MTQ1_OUT2: JP5.2 U10.4(AOUT2)
MTQ2_OUT1: JP6.1 U10.7(BOUT1)
MTQ2_OUT2: JP6.2 U10.5(BOUT2)
MTQ3_OUT1: JP7.1 U11.2(AOUT1)
MTQ3_OUT2: JP7.2 U11.4(AOUT2)
MTQ4_OUT1: JP8.1 U11.7(BOUT1)
MTQ4_OUT2: JP8.2 U11.5(BOUT2)
MTQ_12_ALERT: R32.2 U13.3(ALERT) ; also sheet 1
MTQ_12_VCC: C158.1 C159.1 C164.1 C165.1 C269.2 R31.2 U10.12(VM) U13.9(VIN-)
MTQ_34_ALERT: R30.2 U12.3(ALERT) ; also sheet 1
MTQ_34_VCC: C161.1 C162.1 C268.2 R29.2 U11.12(VM) U12.9(VIN-)
N$10: C157.1 U10.14(VINT)
N$12: R19.1 U10.3(AISEN)
N$13: R20.1 U10.6(BISEN)
N$14: C160.1 U11.14(VINT)
N$15: R27.1 U11.3(AISEN)
N$16: R28.1 U11.6(BISEN)
SMC_I2C0_SCL: U12.5(SCL) U13.5(SCL) ; also sheet 1,5,9,10
SMC_I2C0_SDA: U12.4(SDA) U13.4(SDA) ; also sheet 1,5,9,10
VCC_3V3_IO: C163.1 C166.1 R13.1 R14.1 R21.1 R22.1 R30.1 R32.1 U12.6(VS) U13.2(A0) U13.6(VS) ; also sheet 1,2,4,5,6,7,8,9,10
VCC_5V0: C268.1 C269.1 R29.1 R31.1 U12.8(VBUS) U12.10(VIN+) U13.8(VBUS) U13.10(VIN+) ; also sheet 1,6,7,9,10
VSS: C157.2 C158.2 C159.2 C160.2 C161.2 C162.2 C163.2 C164.2 C165.2 C166.2 R15.2 R16.2 R17.2 R18.2 R19.2 R20.2 R23.2 R24.2 R25.2 R26.2 R27.2 R28.2 U10.13(GND) U10.17(PPAD) U11.13(GND) U11.17(PPAD) U12.1(A1) U12.2(A0) U12.7(GND) U13.1(A1) U13.7(GND) ; also sheet 1,2,4,5,6,7,8,9,10
Unconnected: U10.11(NC) U11.11(NC)

### Notes on the sheet
- Driver 1
- I2C0 Address 0x41
- Driver 2
- I2C0 Address 0x40

## Sheet 4 of 10: CPLD
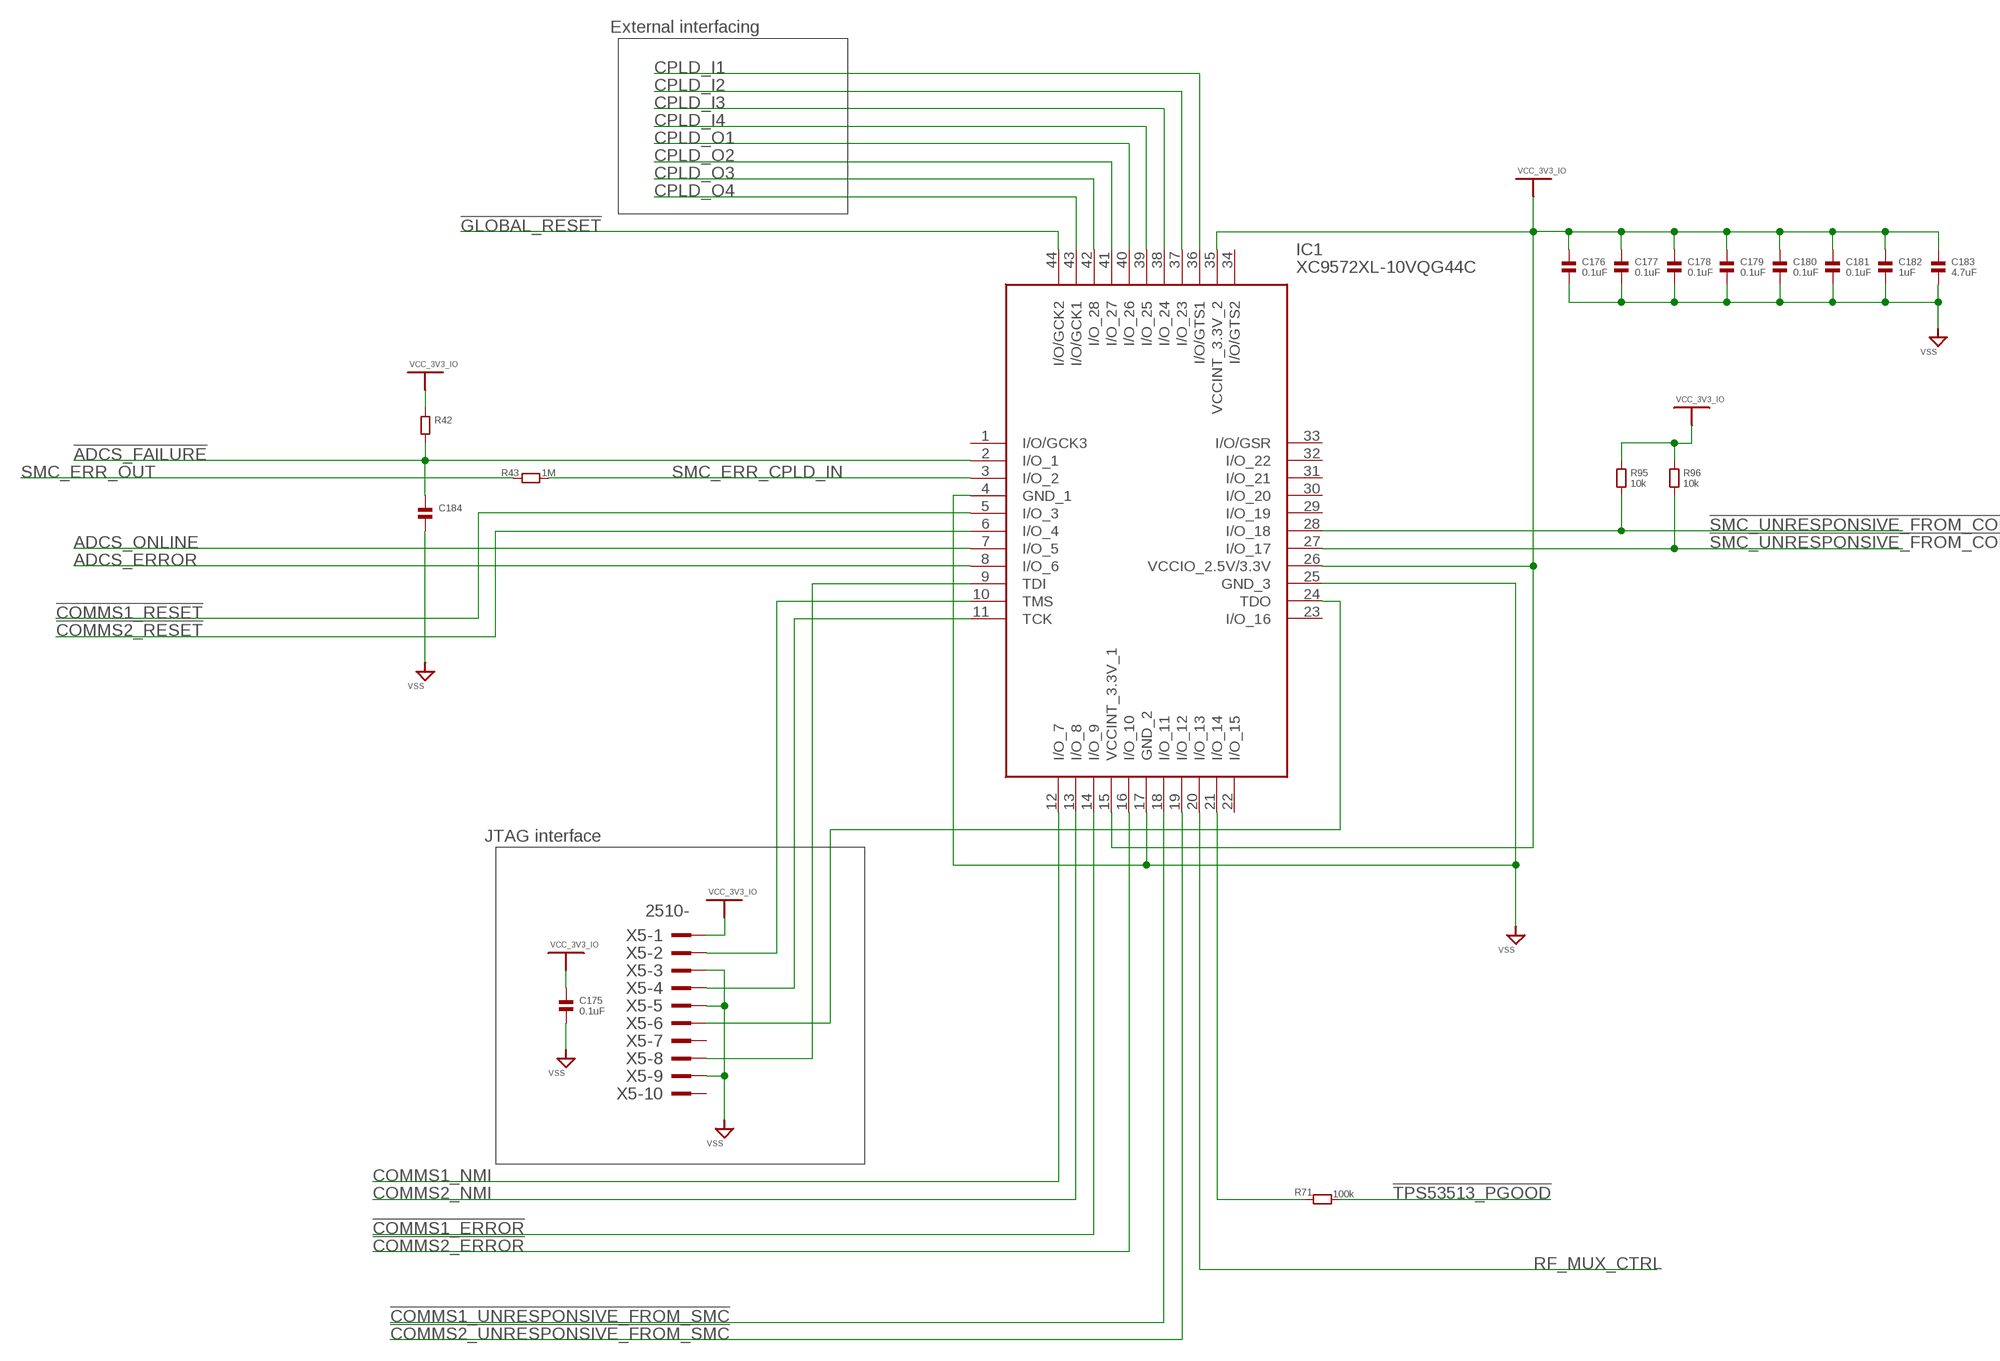
[diagram p4: schematic, sheet 4]

### Parts
C175  0.1uF  CAPACITOR.0603  [0603]
C176  0.1uF  CAPACITOR.0603  [0603]
C177  0.1uF  CAPACITOR.0603  [0603]
C178  0.1uF  CAPACITOR.0603  [0603]
C179  0.1uF  CAPACITOR.0603  [0603]
C180  0.1uF  CAPACITOR.0603  [0603]
C181  0.1uF  CAPACITOR.0603  [0603]
C182  1uF  CAPACITOR.0603  [0603]
C183  4.7uF  CAPACITOR.0603  [0603]
C184  CAPACITOR.0603  [0603]
IC1  XC9572XL-10VQG44C  [QFP80P1200X1200X120-44N]
R42  RESISTOR.0603  [0603]
R43  1M  RESISTOR.0603  [0603]
R71  100k  RESISTOR.0603  [0603]
R95  10k  RESISTOR.0603  [0603]
R96  10k  RESISTOR.0603  [0603]
X5  2510-  [PAK100/2500-10]

### Nets
!ADCS_FAILURE: C184.1 IC1.2(I/O_1) R42.2
!COMMS1_ERROR: IC1.14(I/O_9) ; also sheet 6
!COMMS1_RESET: IC1.5(I/O_3) ; also sheet 6
!COMMS1_UNRESPONSIVE_FROM_SMC: IC1.18(I/O_11) ; also sheet 1
!COMMS2_ERROR: IC1.16(I/O_10) ; also sheet 7
!COMMS2_RESET: IC1.6(I/O_4) ; also sheet 7
!COMMS2_UNRESPONSIVE_FROM_SMC: IC1.19(I/O_12) ; also sheet 1
!GLOBAL_RESET: IC1.44(I/O/GCK2) ; also sheet 1,6,7
!SMC_UNRESPONSIVE_FROM_COMMS1: IC1.28(I/O_18) R95.2 ; also sheet 6
!SMC_UNRESPONSIVE_FROM_COMMS2: IC1.27(I/O_17) R96.2 ; also sheet 7
!TPS53513_PGOOD: R71.2 ; also sheet 1,9
ADCS_ERROR: IC1.8(I/O_6) ; also sheet 10
ADCS_ONLINE: IC1.7(I/O_5) ; also sheet 10
COMMS1_NMI: IC1.12(I/O_7) ; also sheet 6
COMMS2_NMI: IC1.13(I/O_8) ; also sheet 7
CPLD_I1: IC1.36(I/O/GTS1) ; also sheet 10
CPLD_I2: IC1.37(I/O_23) ; also sheet 10
CPLD_I3: IC1.38(I/O_24) ; also sheet 10
CPLD_I4: IC1.39(I/O_25) ; also sheet 10
CPLD_O1: IC1.40(I/O_26) ; also sheet 10
CPLD_O2: IC1.41(I/O_27) ; also sheet 10
CPLD_O3: IC1.42(I/O_28) ; also sheet 10
CPLD_O4: IC1.43(I/O/GCK1) ; also sheet 10
N$18: IC1.10(TMS) X5.2
N$19: IC1.11(TCK) X5.4
N$29: IC1.9(TDI) X5.8
N$30: IC1.24(TDO) X5.6
N$45: IC1.21(I/O_14) R71.1
RF_MUX_CTRL: IC1.20(I/O_13) ; also sheet 8
SMC_ERR_CPLD_IN: IC1.3(I/O_2) R43.2
SMC_ERR_OUT: R43.1 ; also sheet 1
VCC_3V3_IO: C175.1 C176.1 C177.1 C178.1 C179.1 C180.1 C181.1 C182.1 C183.1 IC1.15(VCCINT_3.3V_1) IC1.26(VCCIO_2.5V/3.3V) IC1.35(VCCINT_3.3V_2) R42.1 R95.1 R96.1 X5.1 ; also sheet 1,2,3,5,6,7,8,9,10
VSS: C175.2 C176.2 C177.2 C178.2 C179.2 C180.2 C181.2 C182.2 C183.2 C184.2 IC1.4(GND_1) IC1.17(GND_2) IC1.25(GND_3) X5.3 X5.5 X5.9 ; also sheet 1,2,3,5,6,7,8,9,10
Unconnected: IC1.1(I/O/GCK3) IC1.22(I/O_15) IC1.23(I/O_16) IC1.29(I/O_19) IC1.30(I/O_20) IC1.31(I/O_21) IC1.32(I/O_22) IC1.33(I/O/GSR) IC1.34(I/O/GTS2) X5.7 X5.10

### Notes on the sheet
- External interfacing
- JTAG interface

## Sheet 5 of 10: SMC Sensors
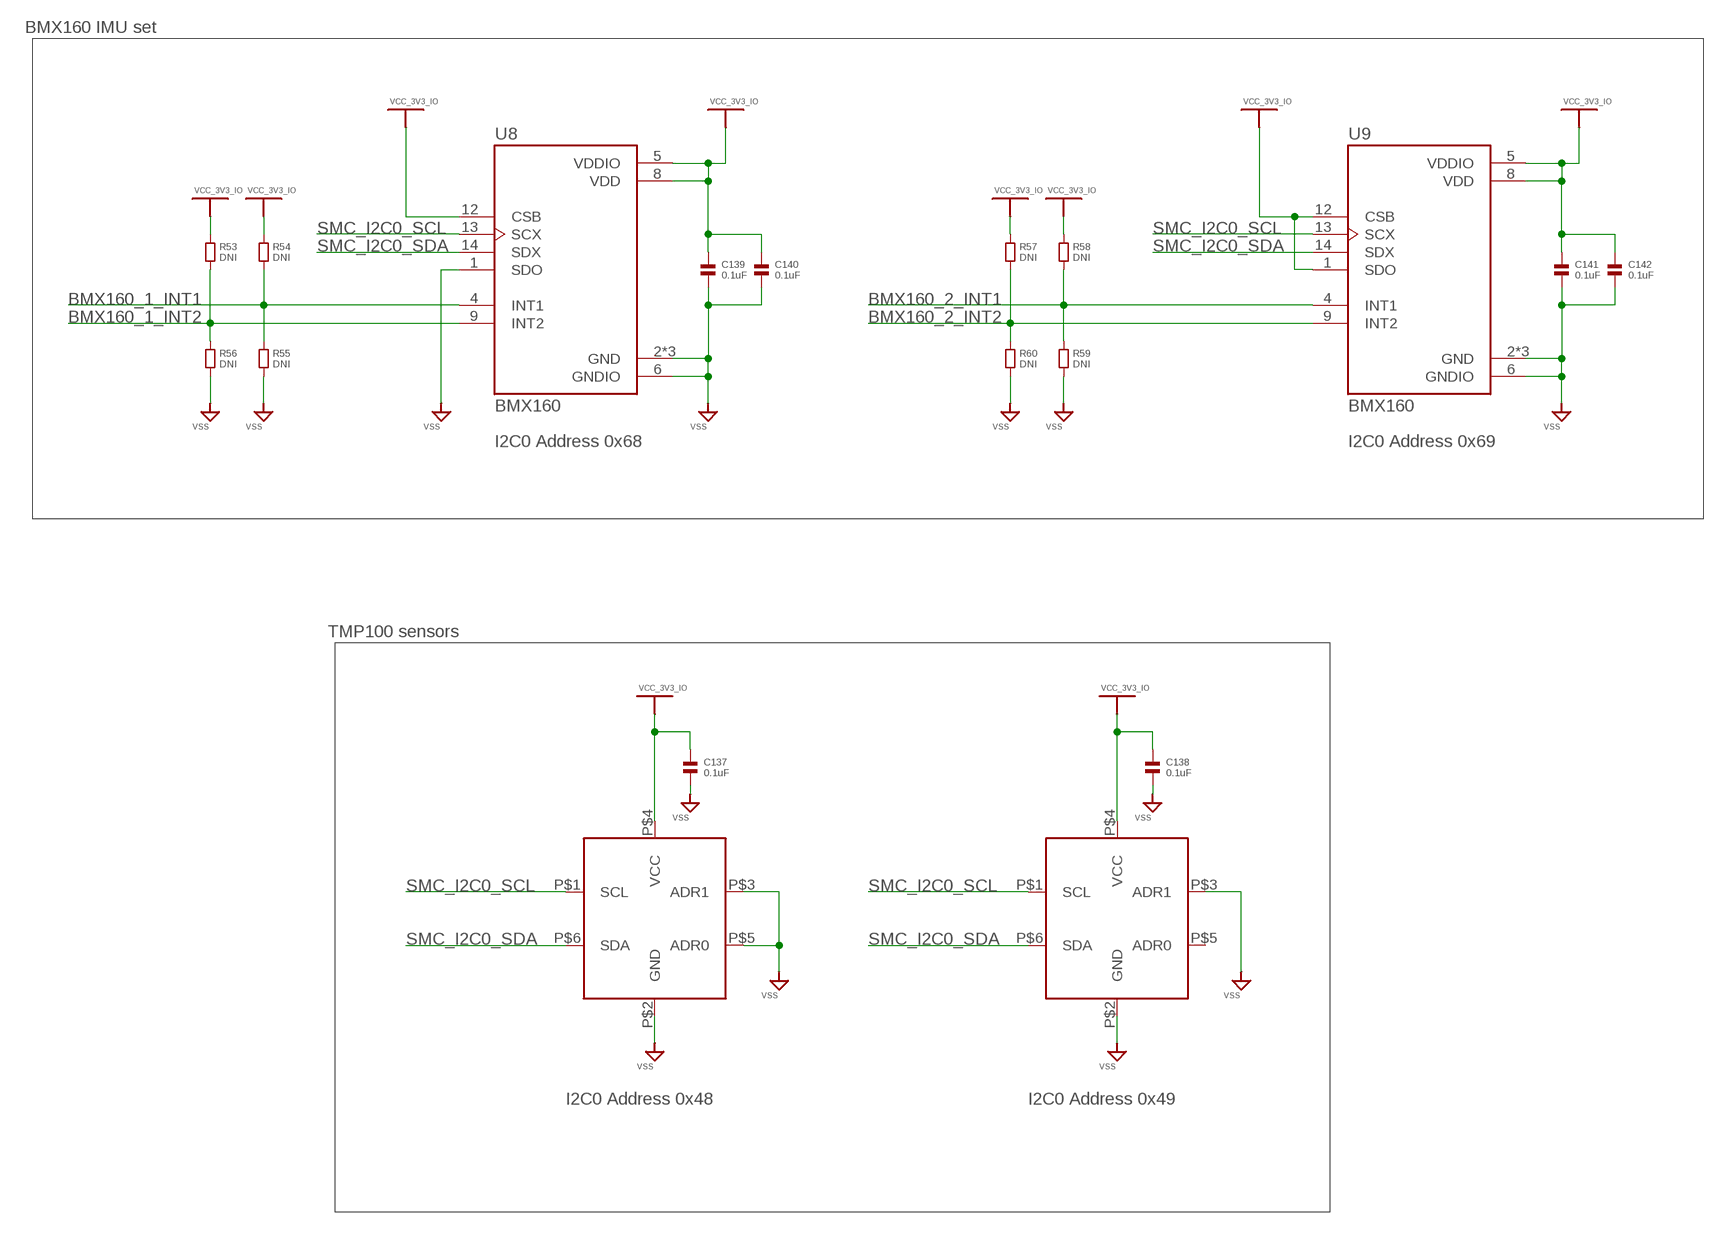
[diagram p5: schematic, sheet 5]

### Parts
C137  0.1uF  CAPACITOR.0603  [0603]
C138  0.1uF  CAPACITOR.0603  [0603]
C139  0.1uF  CAPACITOR.0603  [0603]
C140  0.1uF  CAPACITOR.0603  [0603]
C141  0.1uF  CAPACITOR.0603  [0603]
C142  0.1uF  CAPACITOR.0603  [0603]
R53  DNI  RESISTOR.0603  [0603]
R54  DNI  RESISTOR.0603  [0603]
R55  DNI  RESISTOR.0603  [0603]
R56  DNI  RESISTOR.0603  [0603]
R57  DNI  RESISTOR.0603  [0603]
R58  DNI  RESISTOR.0603  [0603]
R59  DNI  RESISTOR.0603  [0603]
R60  DNI  RESISTOR.0603  [0603]
U7  TMP100  [SOT23-6]
U8  BMX160  [PQFN50P250X300X100-14N]
U9  BMX160  [PQFN50P250X300X100-14N]
U34  TMP100  [SOT23-6]

### Nets
BMX160_1_INT1: R54.2 R55.1 U8.4(INT1) ; also sheet 1
BMX160_1_INT2: R53.2 R56.1 U8.9(INT2) ; also sheet 1
BMX160_2_INT1: R58.2 R59.1 U9.4(INT1) ; also sheet 1
BMX160_2_INT2: R57.2 R60.1 U9.9(INT2) ; also sheet 1
SMC_I2C0_SCL: U7.P$1(SCL) U8.13(SCX) U9.13(SCX) U34.P$1(SCL) ; also sheet 1,3,9,10
SMC_I2C0_SDA: U7.P$6(SDA) U8.14(SDX) U9.14(SDX) U34.P$6(SDA) ; also sheet 1,3,9,10
VCC_3V3_IO: C137.1 C138.1 C139.1 C140.1 C141.1 C142.1 R53.1 R54.1 R57.1 R58.1 U7.P$4(VCC) U8.5(VDDIO) U8.8(VDD) U8.12(CSB) U9.1(SDO) U9.5(VDDIO) U9.8(VDD) U9.12(CSB) U34.P$4(VCC) ; also sheet 1,2,3,4,6,7,8,9,10
VSS: C137.2 C138.2 C139.2 C140.2 C141.2 C142.2 R55.2 R56.2 R59.2 R60.2 U7.P$2(GND) U7.P$3(ADR1) U8.1(SDO) U8.2(GND) U8.3(GND) U8.6(GNDIO) U8.7(GND) U9.2(GND) U9.3(GND) U9.6(GNDIO) U9.7(GND) U34.P$2(GND) U34.P$3(ADR1) U34.P$5(ADR0) ; also sheet 1,2,3,4,6,7,8,9,10
Unconnected: U7.P$5(ADR0)

### Notes on the sheet
- BMX160 IMU set
- I2C0 Address 0x68 | I2C0 Address 0x69
- TMP100 sensors
- I2C0 Address 0x48 | I2C0 Address 0x49

## Sheet 6 of 10: Comms MCU General + CC1200 (Primary)
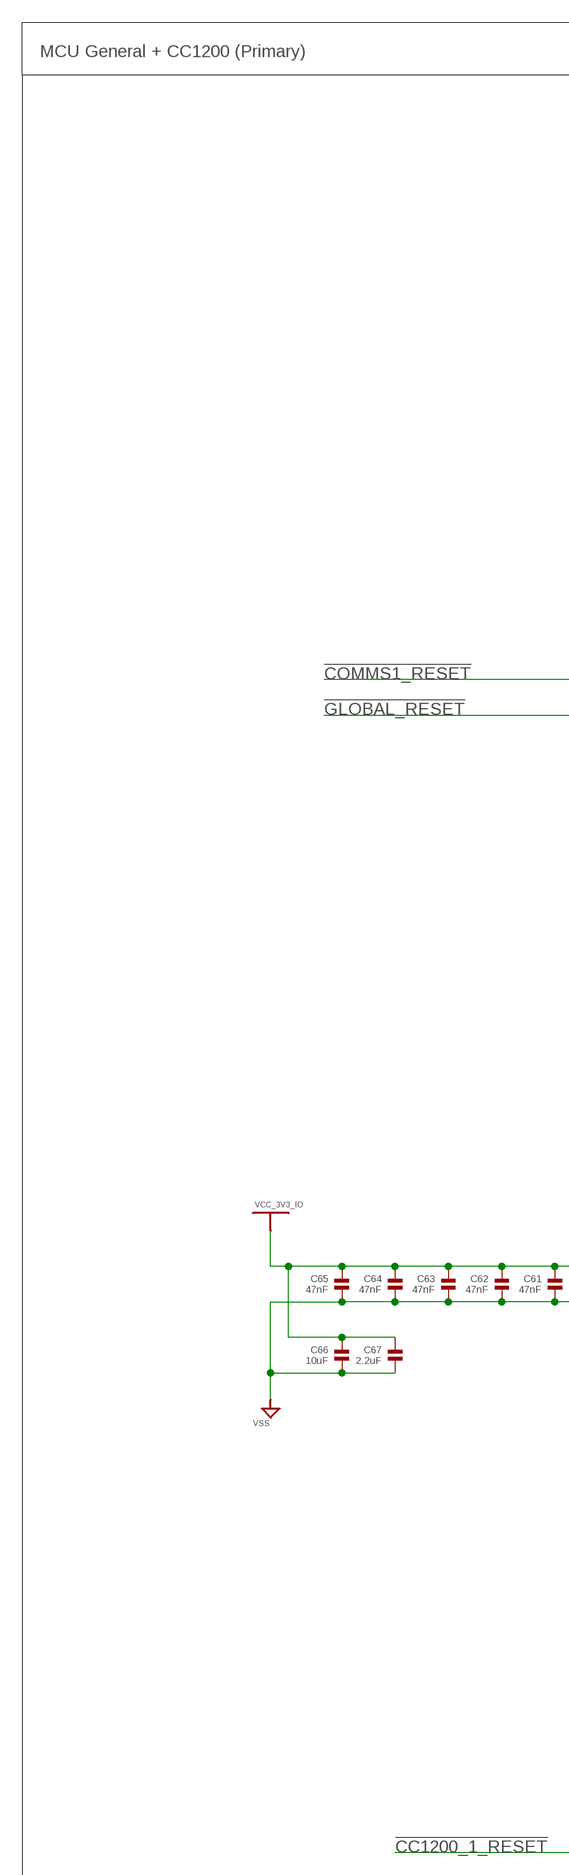
[diagram p6: schematic, sheet 6, part 1 of 2]
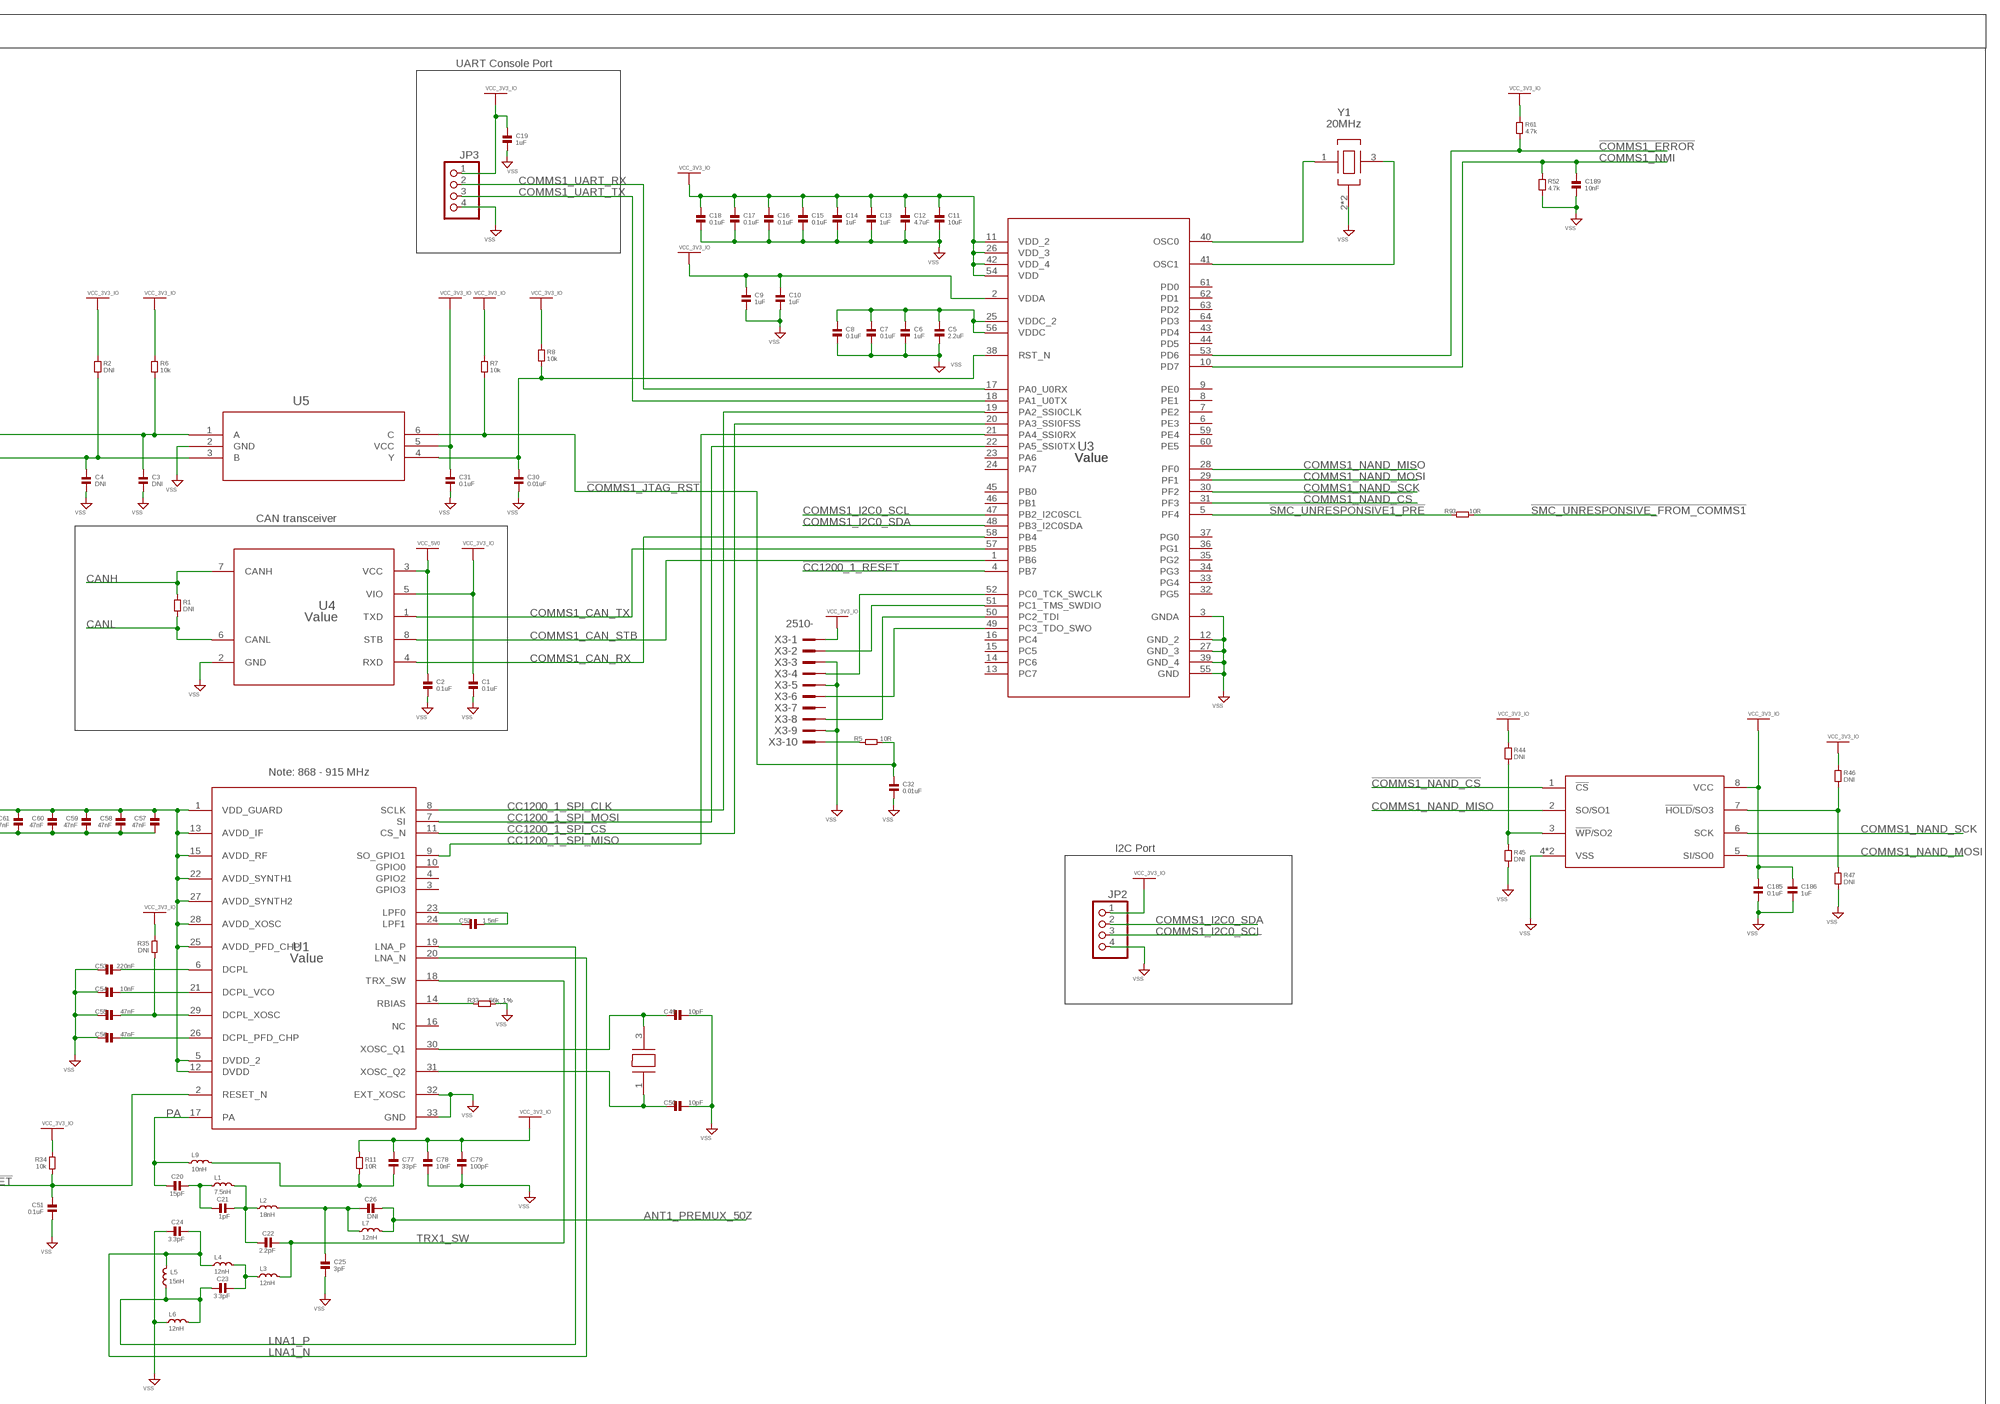
[diagram p7: schematic, sheet 6, part 2 of 2]

### Parts
C1  0.1uF  CAPACITOR.0603  [0603]
C2  0.1uF  CAPACITOR.0603  [0603]
C3  DNI  CAPACITOR.0603  [0603]
C4  DNI  CAPACITOR.0603  [0603]
C5  2.2uF  CAPACITOR.0603  [0603]
C6  1uF  CAPACITOR.0603  [0603]
C7  0.1uF  CAPACITOR.0603  [0603]
C8  0.1uF  CAPACITOR.0603  [0603]
C9  1uF  CAPACITOR.0603  [0603]
C10  1uF  CAPACITOR.0603  [0603]
C11  10uF  CAPACITOR.0603  [0603]
C12  4.7uF  CAPACITOR.0603  [0603]
C13  1uF  CAPACITOR.0603  [0603]
C14  1uF  CAPACITOR.0603  [0603]
C15  0.1uF  CAPACITOR.0603  [0603]
C16  0.1uF  CAPACITOR.0603  [0603]
C17  0.1uF  CAPACITOR.0603  [0603]
C18  0.1uF  CAPACITOR.0603  [0603]
C19  1uF  CAPACITOR.0603  [0603]
C20  15pF  CAPACITOR.0402  [0402]
C21  1pF  CAPACITOR.0402  [0402]
C22  2.2pF  CAPACITOR.0402  [0402]
C23  3.3pF  CAPACITOR.0402  [0402]
C24  3.3pF  CAPACITOR.0402  [0402]
C25  3pF  CAPACITOR.0402  [0402]
C26  DNI  CAPACITOR.0402  [0402]
C30  0.01uF  CAPACITOR.0603  [0603]
C31  0.1uF  CAPACITOR.0603  [0603]
C32  0.01uF  CAPACITOR.0603  [0603]
C49  10pF  CAPACITOR.0603  [0603]
C50  10pF  CAPACITOR.0603  [0603]
C51  0.1uF  CAPACITOR.0603  [0603]
C52  1.5nF  CAPACITOR.0402  [0402]
C53  220nF  CAPACITOR.0402  [0402]
C54  10nF  CAPACITOR.0402  [0402]
C55  47nF  CAPACITOR.0402  [0402]
C56  47nF  CAPACITOR.0402  [0402]
C57  47nF  CAPACITOR.0402  [0402]
C58  47nF  CAPACITOR.0402  [0402]
C59  47nF  CAPACITOR.0402  [0402]
C60  47nF  CAPACITOR.0402  [0402]
C61  47nF  CAPACITOR.0402  [0402]
C62  47nF  CAPACITOR.0402  [0402]
C63  47nF  CAPACITOR.0402  [0402]
C64  47nF  CAPACITOR.0402  [0402]
C65  47nF  CAPACITOR.0402  [0402]
C66  10uF  CAPACITOR.0603  [0603]
C67  2.2uF  CAPACITOR.0603  [0603]
C77  33pF  CAPACITOR.0402  [0402]
C78  10nF  CAPACITOR.0402  [0402]
C79  100pF  CAPACITOR.0402  [0402]
C185  0.1uF  CAPACITOR.0603  [0603]
C186  1uF  CAPACITOR.0603  [0603]
C189  10nF  CAPACITOR.0603  [0603]
JP2  PINHD-1X4  [1X04]
JP3  PINHD-1X4  [1X04]
L1  7.5nH  RF-INDUCTOR.0402  [0402]
L2  18nH  RF-INDUCTOR.0402  [0402]
L3  12nH  RF-INDUCTOR.0402  [0402]
L4  12nH  RF-INDUCTOR.0402  [0402]
L5  15nH  RF-INDUCTOR.0402  [0402]
L6  12nH  RF-INDUCTOR.0402  [0402]
L7  12nH  RF-INDUCTOR.0402  [0402]
L9  10nH  RF-INDUCTOR.0402  [0402]
R1  DNI  RESISTOR.0603  [0603]
R2  DNI  RESISTOR.0603  [0603]
R5  10R  RESISTOR.0603  [0603]
R6  10k  RESISTOR.0603  [0603]
R7  10k  RESISTOR.0603  [0603]
R8  10k  RESISTOR.0603  [0603]
R11  10R  RESISTOR.0402  [0402]
R33  56k_1%  RESISTOR.0603  [0603]
R34  10k  RESISTOR.0603  [0603]
R35  DNI  RESISTOR.0402  [0402]
R44  DNI  RESISTOR.0603  [0603]
R45  DNI  RESISTOR.0603  [0603]
R46  DNI  RESISTOR.0603  [0603]
R47  DNI  RESISTOR.0603  [0603]
R52  4.7k  RESISTOR.0603  [0603]
R61  4.7k  RESISTOR.0603  [0603]
R93  10R  RESISTOR.0603  [0603]
U1  Value  TEXAS_INSTRUMENTS-RADAR-CC1200RHBR  [TEXAS_INSTRUMENTS-RADAR-CC1200RHBR]
U3  Value  TEXAS_INSTRUMENTS-MICROCONTROLLER-TM4C1230D5PMI7R  [PM0064A_N]
U4  Value  TEXAS_INSTRUMENTS-CAN_TRANSCEIVER-TCAN1042VDRQ1  [TEXAS_INSTRUMENTS-CAN_TRANSCEIVER-TCAN1042/LED_DRIVER-TLC59731DR]
U5  TEXAS_INSTRUMENTS-AND_GATE-SN74LVC1G11_DCK_6  [TEXAS_INSTRUMENTS-AND_GATE-SN74LVC1G11_DCK_6]
U15  KIOXIA_AMERICA-NAND_FLASH-TC58CVG0S3HRAIG  [KIOXIA_AMERICA-NAND_FLASH-TC58CVG0S3HRAIG]
X1  ECS_INC-OSCILLATOR-ECS-400-10-37-CKM-TR  [ECS_INC-OSCILLATOR-ECS-400-10-37-CKM-TR]
X3  2510-  [PAK100/2500-10]
Y1  20MHz  ESC-OSCILLATOR-ECS_200_9_33B_CTP_TR  [ESC-OSCILLATOR-ECS_200_9_33B_CTP_TR]

### Nets
!CC1200_1_RESET: C51.1 R34.2 U1.2(RESET_N) U3.4(PB7)
!CC1200_1_SPI_CS: U1.11(CS_N) U3.20(PA3_SSI0FSS)
!COMMS1_ERROR: R61.2 U3.53(PD6) ; also sheet 4
!COMMS1_JTAG_RST: C32.1 R5.2 R7.2 U5.6(C)
!COMMS1_NAND_CS: U3.31(PF3) U15.1(!CS)
!COMMS1_RESET: C3.1 R6.2 U5.1(A) ; also sheet 4
!GLOBAL_RESET: C4.1 R2.2 U5.3(B) ; also sheet 1,4,7
!SMC_UNRESPONSIVE1_PRE: R93.1 U3.5(PF4)
!SMC_UNRESPONSIVE_FROM_COMMS1: R93.2 ; also sheet 4
ANT1_PREMUX_50Z: C26.2 L7.2 ; also sheet 8
CANH: R1.1 U4.7(CANH) ; also sheet 1,7,10
CANL: R1.2 U4.6(CANL) ; also sheet 1,7,10
CC1200_1_SPI_CLK: U1.8(SCLK) U3.19(PA2_SSI0CLK)
CC1200_1_SPI_MISO: U1.9(SO_GPIO1) U3.21(PA4_SSI0RX)
CC1200_1_SPI_MOSI: U1.7(SI) U3.22(PA5_SSI0TX)
COMMS1_CAN_RX: U3.58(PB4) U4.4(RXD)
COMMS1_CAN_STB: U3.1(PB6) U4.8(STB)
COMMS1_CAN_TX: U3.57(PB5) U4.1(TXD)
COMMS1_I2C0_SCL: JP2.3 U3.47(PB2_I2C0SCL)
COMMS1_I2C0_SDA: JP2.2 U3.48(PB3_I2C0SDA)
COMMS1_NAND_MISO: U3.28(PF0) U15.2(SO/SO1)
COMMS1_NAND_MOSI: U3.29(PF1) U15.5(SI/SO0)
COMMS1_NAND_SCK: U3.30(PF2) U15.6(SCK)
COMMS1_NMI: C189.1 R52.1 U3.10(PD7) ; also sheet 4
COMMS1_UART_RX: JP3.2 U3.17(PA0_U0RX) ; also sheet 10
COMMS1_UART_TX: JP3.3 U3.18(PA1_U0TX) ; also sheet 10
LNA1_N: C24.2 L4.1 L5.2 U1.20(LNA_N)
LNA1_P: C23.1 L5.1 L6.2 U1.19(LNA_P)
N$2: C5.1 C6.1 C7.1 C8.1 U3.25(VDDC_2) U3.56(VDDC)
N$3: U3.40(OSC0) Y1.1(XI)
N$4: U3.41(OSC1) Y1.3(XO)
N$5: C20.2 C21.1 L1.1
N$6: C23.2 L3.1 L4.2
N$7: C21.2 C22.1 L1.2 L2.1
N$9: C25.1 C26.1 L2.2 L7.1
N$11: C77.2 L9.2 R11.2
N$17: R44.2 R45.1 U15.3(!WP!/SO2)
N$20: R5.1 X3.10
N$21: C30.1 R8.2 U3.38(RST_N) U5.4(Y)
N$22: U3.50(PC2_TDI) X3.8
N$23: R33.1 U1.14(RBIAS)
N$24: C49.1 U1.30(XOSC_Q1) X1.3(XO)
N$25: C50.1 U1.31(XOSC_Q2) X1.1(XI)
N$26: U3.49(PC3_TDO_SWO) X3.6
N$27: U3.51(PC1_TMS_SWDIO) X3.2
N$28: U3.52(PC0_TCK_SWCLK) X3.4
N$31: C52.1 U1.24(LPF1)
N$32: C52.2 U1.23(LPF0)
N$33: C56.2 U1.26(DCPL_PFD_CHP)
N$34: C55.2 R35.2 U1.29(DCPL_XOSC)
N$35: C54.2 U1.21(DCPL_VCO)
N$36: C53.2 U1.6(DCPL)
N$38: R46.2 R47.1 U15.7(!HOLD!/SO3)
PA: C20.1 L9.1 U1.17(PA) ; also sheet 7
TRX1_SW: C22.2 L3.2 U1.18(TRX_SW)
VCC_3V3_IO: C1.1 C9.1 C10.1 C11.1 C12.1 C13.1 C14.1 C15.1 C16.1 C17.1 C18.1 C19.1 C31.1 C57.1 C58.1 C59.1 C60.1 C61.1 C62.1 C63.1 C64.1 C65.1 C66.1 C67.1 C77.1 C78.1 C79.1 C185.1 C186.1 JP2.1 JP3.1 R2.1 R6.1 R7.1 R8.1 R11.1 R34.1 R35.1 R44.1 R46.1 R61.1 U1.1(VDD_GUARD) U1.5(DVDD_2) U1.12(DVDD) U1.13(AVDD_IF) U1.15(AVDD_RF) U1.22(AVDD_SYNTH1) U1.25(AVDD_PFD_CHP) U1.27(AVDD_SYNTH2) U1.28(AVDD_XOSC) U3.2(VDDA) U3.11(VDD_2) U3.26(VDD_3) U3.42(VDD_4) U3.54(VDD) U4.5(VIO) U5.5(VCC) U15.8(VCC) X3.1 ; also sheet 1,2,3,4,5,7,8,9,10
VCC_5V0: C2.1 U4.3(VCC) ; also sheet 1,3,7,9,10
VSS: C1.2 C2.2 C3.2 C4.2 C5.2 C6.2 C7.2 C8.2 C9.2 C10.2 C11.2 C12.2 C13.2 C14.2 C15.2 C16.2 C17.2 C18.2 C19.2 C24.1 C25.2 C30.2 C31.2 C32.2 C49.2 C50.2 C51.2 C53.1 C54.1 C55.1 C56.1 C57.2 C58.2 C59.2 C60.2 C61.2 C62.2 C63.2 C64.2 C65.2 C66.2 C67.2 C78.2 C79.2 C185.2 C186.2 C189.2 JP2.4 JP3.4 L6.1 R33.2 R45.2 R47.2 R52.2 U1.32(EXT_XOSC) U1.33(GND) U3.3(GNDA) U3.12(GND_2) U3.27(GND_3) U3.39(GND_4) U3.55(GND) U4.2(GND) U5.2(GND) U15.4(VSS) U15.9(VSS) X3.3 X3.5 X3.9 Y1.2(VSS) Y1.4(VSS) ; also sheet 1,2,3,4,5,7,8,9,10
Unconnected: U1.3(GPIO3) U1.4(GPIO2) U1.10(GPIO0) U1.16(NC) U3.6(PE3) U3.7(PE2) U3.8(PE1) U3.9(PE0) U3.13(PC7) U3.14(PC6) U3.15(PC5) U3.16(PC4) U3.23(PA6) U3.24(PA7) U3.32(PG5) U3.33(PG4) U3.34(PG3) U3.35(PG2) U3.36(PG1) U3.37(PG0) U3.43(PD4) U3.44(PD5) U3.45(PB0) U3.46(PB1) U3.59(PE4) U3.60(PE5) U3.61(PD0) U3.62(PD1) U3.63(PD2) U3.64(PD3) X3.7

### Notes on the sheet
- MCU General + CC1200 (Primary)
- UART Console Port
- CAN transceiver
- Note: 868 - 915 MHz
- I2C Port

## Sheet 7 of 10: Comms MCU General + CC1200 (Secondary)
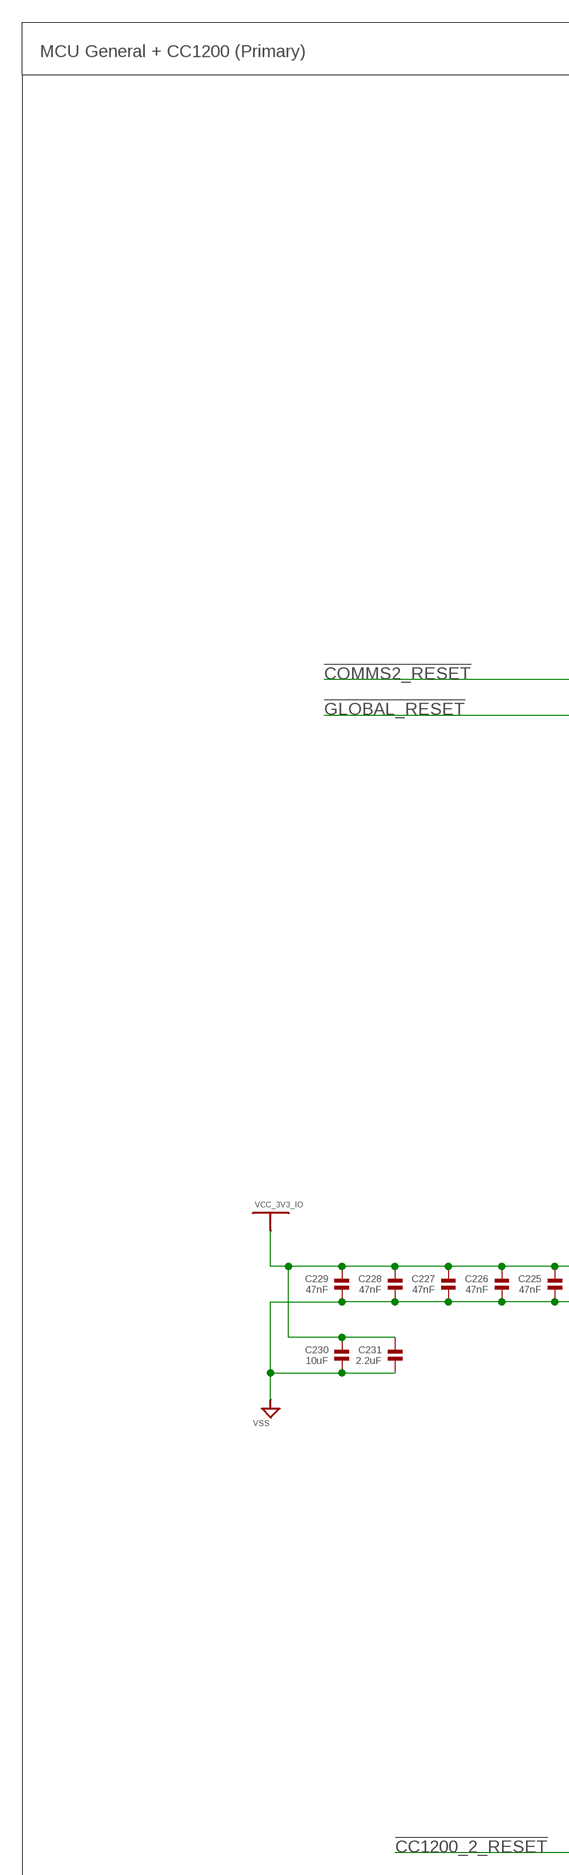
[diagram p8: schematic, sheet 7, part 1 of 2]
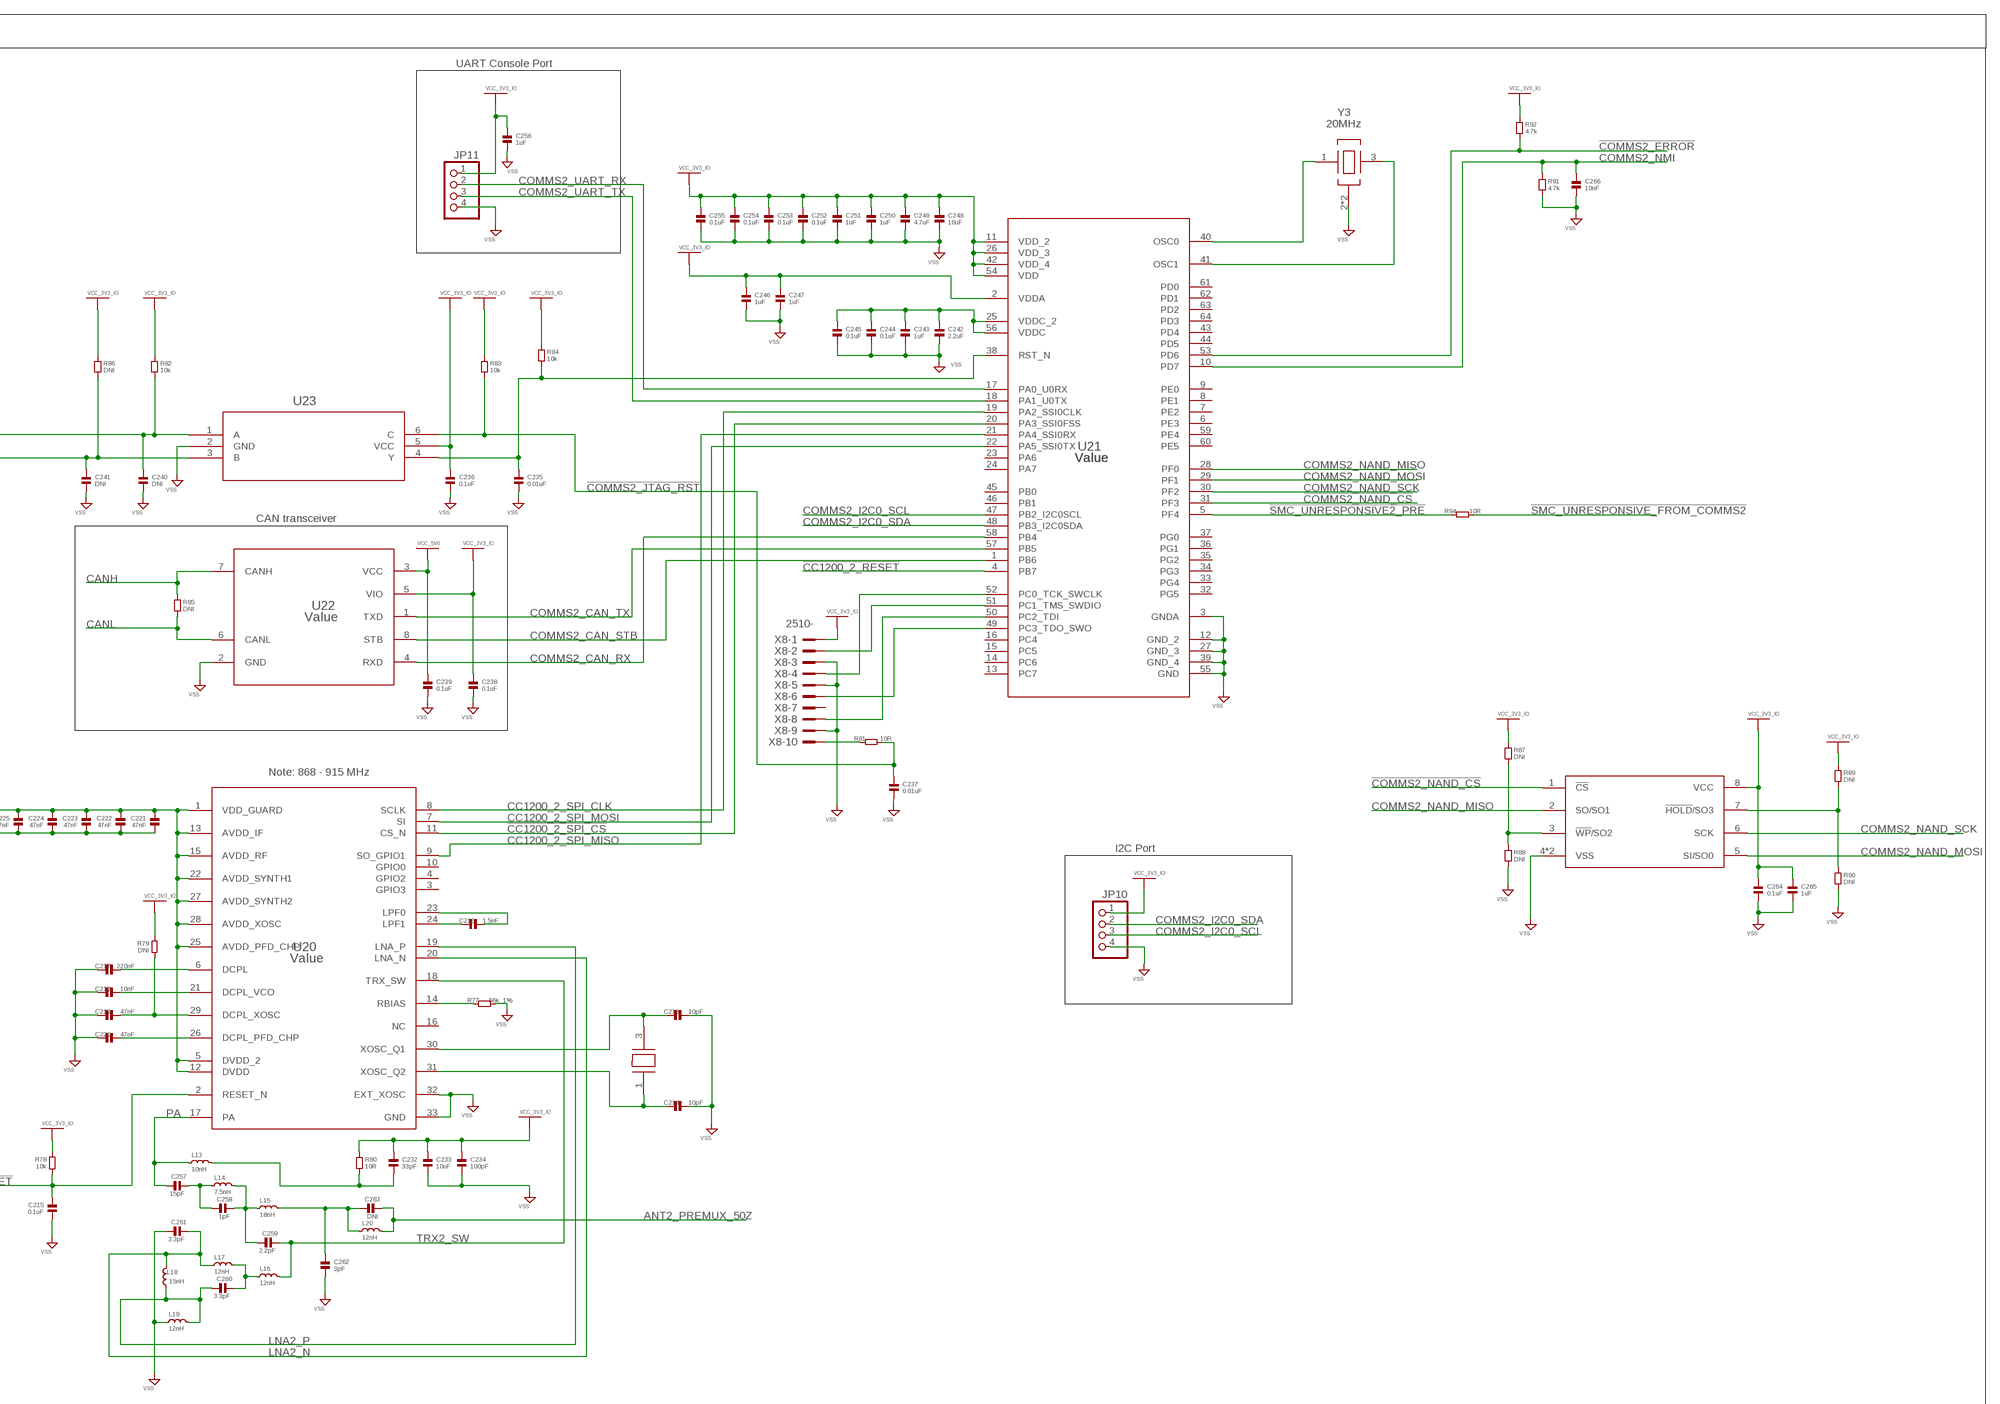
[diagram p9: schematic, sheet 7, part 2 of 2]

### Parts
C213  10pF  CAPACITOR.0603  [0603]
C214  10pF  CAPACITOR.0603  [0603]
C215  0.1uF  CAPACITOR.0603  [0603]
C216  1.5nF  CAPACITOR.0402  [0402]
C217  220nF  CAPACITOR.0402  [0402]
C218  10nF  CAPACITOR.0402  [0402]
C219  47nF  CAPACITOR.0402  [0402]
C220  47nF  CAPACITOR.0402  [0402]
C221  47nF  CAPACITOR.0402  [0402]
C222  47nF  CAPACITOR.0402  [0402]
C223  47nF  CAPACITOR.0402  [0402]
C224  47nF  CAPACITOR.0402  [0402]
C225  47nF  CAPACITOR.0402  [0402]
C226  47nF  CAPACITOR.0402  [0402]
C227  47nF  CAPACITOR.0402  [0402]
C228  47nF  CAPACITOR.0402  [0402]
C229  47nF  CAPACITOR.0402  [0402]
C230  10uF  CAPACITOR.0603  [0603]
C231  2.2uF  CAPACITOR.0603  [0603]
C232  33pF  CAPACITOR.0402  [0402]
C233  10nF  CAPACITOR.0402  [0402]
C234  100pF  CAPACITOR.0402  [0402]
C235  0.01uF  CAPACITOR.0603  [0603]
C236  0.1uF  CAPACITOR.0603  [0603]
C237  0.01uF  CAPACITOR.0603  [0603]
C238  0.1uF  CAPACITOR.0603  [0603]
C239  0.1uF  CAPACITOR.0603  [0603]
C240  DNI  CAPACITOR.0603  [0603]
C241  DNI  CAPACITOR.0603  [0603]
C242  2.2uF  CAPACITOR.0603  [0603]
C243  1uF  CAPACITOR.0603  [0603]
C244  0.1uF  CAPACITOR.0603  [0603]
C245  0.1uF  CAPACITOR.0603  [0603]
C246  1uF  CAPACITOR.0603  [0603]
C247  1uF  CAPACITOR.0603  [0603]
C248  10uF  CAPACITOR.0603  [0603]
C249  4.7uF  CAPACITOR.0603  [0603]
C250  1uF  CAPACITOR.0603  [0603]
C251  1uF  CAPACITOR.0603  [0603]
C252  0.1uF  CAPACITOR.0603  [0603]
C253  0.1uF  CAPACITOR.0603  [0603]
C254  0.1uF  CAPACITOR.0603  [0603]
C255  0.1uF  CAPACITOR.0603  [0603]
C256  1uF  CAPACITOR.0603  [0603]
C257  15pF  CAPACITOR.0402  [0402]
C258  1pF  CAPACITOR.0402  [0402]
C259  2.2pF  CAPACITOR.0402  [0402]
C260  3.3pF  CAPACITOR.0402  [0402]
C261  3.3pF  CAPACITOR.0402  [0402]
C262  3pF  CAPACITOR.0402  [0402]
C263  DNI  CAPACITOR.0402  [0402]
C264  0.1uF  CAPACITOR.0603  [0603]
C265  1uF  CAPACITOR.0603  [0603]
C266  10nF  CAPACITOR.0603  [0603]
JP10  PINHD-1X4  [1X04]
JP11  PINHD-1X4  [1X04]
L13  10nH  RF-INDUCTOR.0402  [0402]
L14  7.5nH  RF-INDUCTOR.0402  [0402]
L15  18nH  RF-INDUCTOR.0402  [0402]
L16  12nH  RF-INDUCTOR.0402  [0402]
L17  12nH  RF-INDUCTOR.0402  [0402]
L18  15nH  RF-INDUCTOR.0402  [0402]
L19  12nH  RF-INDUCTOR.0402  [0402]
L20  12nH  RF-INDUCTOR.0402  [0402]
R77  56k_1%  RESISTOR.0603  [0603]
R78  10k  RESISTOR.0603  [0603]
R79  DNI  RESISTOR.0402  [0402]
R80  10R  RESISTOR.0402  [0402]
R81  10R  RESISTOR.0603  [0603]
R82  10k  RESISTOR.0603  [0603]
R83  10k  RESISTOR.0603  [0603]
R84  10k  RESISTOR.0603  [0603]
R85  DNI  RESISTOR.0603  [0603]
R86  DNI  RESISTOR.0603  [0603]
R87  DNI  RESISTOR.0603  [0603]
R88  DNI  RESISTOR.0603  [0603]
R89  DNI  RESISTOR.0603  [0603]
R90  DNI  RESISTOR.0603  [0603]
R91  4.7k  RESISTOR.0603  [0603]
R92  4.7k  RESISTOR.0603  [0603]
R94  10R  RESISTOR.0603  [0603]
U20  Value  TEXAS_INSTRUMENTS-RADAR-CC1200RHBR  [TEXAS_INSTRUMENTS-RADAR-CC1200RHBR]
U21  Value  TEXAS_INSTRUMENTS-MICROCONTROLLER-TM4C1230D5PMI7R  [PM0064A_N]
U22  Value  TEXAS_INSTRUMENTS-CAN_TRANSCEIVER-TCAN1042VDRQ1  [TEXAS_INSTRUMENTS-CAN_TRANSCEIVER-TCAN1042/LED_DRIVER-TLC59731DR]
U23  TEXAS_INSTRUMENTS-AND_GATE-SN74LVC1G11_DCK_6  [TEXAS_INSTRUMENTS-AND_GATE-SN74LVC1G11_DCK_6]
U24  KIOXIA_AMERICA-NAND_FLASH-TC58CVG0S3HRAIG  [KIOXIA_AMERICA-NAND_FLASH-TC58CVG0S3HRAIG]
X7  ECS_INC-OSCILLATOR-ECS-400-10-37-CKM-TR  [ECS_INC-OSCILLATOR-ECS-400-10-37-CKM-TR]
X8  2510-  [PAK100/2500-10]
Y3  20MHz  ESC-OSCILLATOR-ECS_200_9_33B_CTP_TR  [ESC-OSCILLATOR-ECS_200_9_33B_CTP_TR]

### Nets
!CC1200_2_RESET: C215.1 R78.2 U20.2(RESET_N) U21.4(PB7)
!CC1200_2_SPI_CS: U20.11(CS_N) U21.20(PA3_SSI0FSS)
!COMMS2_ERROR: R92.2 U21.53(PD6) ; also sheet 4
!COMMS2_JTAG_RST: C237.1 R81.2 R83.2 U23.6(C)
!COMMS2_NAND_CS: U21.31(PF3) U24.1(!CS)
!COMMS2_RESET: C240.1 R82.2 U23.1(A) ; also sheet 4
!GLOBAL_RESET: C241.1 R86.2 U23.3(B) ; also sheet 1,4,6
!SMC_UNRESPONSIVE2_PRE: R94.1 U21.5(PF4)
!SMC_UNRESPONSIVE_FROM_COMMS2: R94.2 ; also sheet 4
ANT2_PREMUX_50Z: C263.2 L20.2 ; also sheet 8
CANH: R85.1 U22.7(CANH) ; also sheet 1,6,10
CANL: R85.2 U22.6(CANL) ; also sheet 1,6,10
CC1200_2_SPI_CLK: U20.8(SCLK) U21.19(PA2_SSI0CLK)
CC1200_2_SPI_MISO: U20.9(SO_GPIO1) U21.21(PA4_SSI0RX)
CC1200_2_SPI_MOSI: U20.7(SI) U21.22(PA5_SSI0TX)
COMMS2_CAN_RX: U21.58(PB4) U22.4(RXD)
COMMS2_CAN_STB: U21.1(PB6) U22.8(STB)
COMMS2_CAN_TX: U21.57(PB5) U22.1(TXD)
COMMS2_I2C0_SCL: JP10.3 U21.47(PB2_I2C0SCL)
COMMS2_I2C0_SDA: JP10.2 U21.48(PB3_I2C0SDA)
COMMS2_NAND_MISO: U21.28(PF0) U24.2(SO/SO1)
COMMS2_NAND_MOSI: U21.29(PF1) U24.5(SI/SO0)
COMMS2_NAND_SCK: U21.30(PF2) U24.6(SCK)
COMMS2_NMI: C266.1 R91.1 U21.10(PD7) ; also sheet 4
COMMS2_UART_RX: JP11.2 U21.17(PA0_U0RX) ; also sheet 10
COMMS2_UART_TX: JP11.3 U21.18(PA1_U0TX) ; also sheet 10
LNA2_N: C261.2 L17.1 L18.2 U20.20(LNA_N)
LNA2_P: C260.1 L18.1 L19.2 U20.19(LNA_P)
N$50: R77.1 U20.14(RBIAS)
N$51: C213.1 U20.30(XOSC_Q1) X7.3(XO)
N$52: C214.1 U20.31(XOSC_Q2) X7.1(XI)
N$53: C216.1 U20.24(LPF1)
N$54: C216.2 U20.23(LPF0)
N$55: C220.2 U20.26(DCPL_PFD_CHP)
N$56: C219.2 R79.2 U20.29(DCPL_XOSC)
N$57: C218.2 U20.21(DCPL_VCO)
N$58: C217.2 U20.6(DCPL)
N$59: C232.2 L13.2 R80.2
N$60: R81.1 X8.10
N$61: C235.1 R84.2 U21.38(RST_N) U23.4(Y)
N$62: U21.50(PC2_TDI) X8.8
N$63: U21.49(PC3_TDO_SWO) X8.6
N$64: U21.51(PC1_TMS_SWDIO) X8.2
N$65: U21.52(PC0_TCK_SWCLK) X8.4
N$66: C242.1 C243.1 C244.1 C245.1 U21.25(VDDC_2) U21.56(VDDC)
N$67: U21.40(OSC0) Y3.1(XI)
N$68: U21.41(OSC1) Y3.3(XO)
N$69: C257.2 C258.1 L14.1
N$70: C258.2 C259.1 L14.2 L15.1
N$71: C260.2 L16.1 L17.2
N$72: C262.1 C263.1 L15.2 L20.1
N$73: R87.2 R88.1 U24.3(!WP!/SO2)
N$74: R89.2 R90.1 U24.7(!HOLD!/SO3)
PA: C257.1 L13.1 U20.17(PA) ; also sheet 6
TRX2_SW: C259.2 L16.2 U20.18(TRX_SW)
VCC_3V3_IO: C221.1 C222.1 C223.1 C224.1 C225.1 C226.1 C227.1 C228.1 C229.1 C230.1 C231.1 C232.1 C233.1 C234.1 C236.1 C238.1 C246.1 C247.1 C248.1 C249.1 C250.1 C251.1 C252.1 C253.1 C254.1 C255.1 C256.1 C264.1 C265.1 JP10.1 JP11.1 R78.1 R79.1 R80.1 R82.1 R83.1 R84.1 R86.1 R87.1 R89.1 R92.1 U20.1(VDD_GUARD) U20.5(DVDD_2) U20.12(DVDD) U20.13(AVDD_IF) U20.15(AVDD_RF) U20.22(AVDD_SYNTH1) U20.25(AVDD_PFD_CHP) U20.27(AVDD_SYNTH2) U20.28(AVDD_XOSC) U21.2(VDDA) U21.11(VDD_2) U21.26(VDD_3) U21.42(VDD_4) U21.54(VDD) U22.5(VIO) U23.5(VCC) U24.8(VCC) X8.1 ; also sheet 1,2,3,4,5,6,8,9,10
VCC_5V0: C239.1 U22.3(VCC) ; also sheet 1,3,6,9,10
VSS: C213.2 C214.2 C215.2 C217.1 C218.1 C219.1 C220.1 C221.2 C222.2 C223.2 C224.2 C225.2 C226.2 C227.2 C228.2 C229.2 C230.2 C231.2 C233.2 C234.2 C235.2 C236.2 C237.2 C238.2 C239.2 C240.2 C241.2 C242.2 C243.2 C244.2 C245.2 C246.2 C247.2 C248.2 C249.2 C250.2 C251.2 C252.2 C253.2 C254.2 C255.2 C256.2 C261.1 C262.2 C264.2 C265.2 C266.2 JP10.4 JP11.4 L19.1 R77.2 R88.2 R90.2 R91.2 U20.32(EXT_XOSC) U20.33(GND) U21.3(GNDA) U21.12(GND_2) U21.27(GND_3) U21.39(GND_4) U21.55(GND) U22.2(GND) U23.2(GND) U24.4(VSS) U24.9(VSS) X8.3 X8.5 X8.9 Y3.2(VSS) Y3.4(VSS) ; also sheet 1,2,3,4,5,6,8,9,10
Unconnected: U20.3(GPIO3) U20.4(GPIO2) U20.10(GPIO0) U20.16(NC) U21.6(PE3) U21.7(PE2) U21.8(PE1) U21.9(PE0) U21.13(PC7) U21.14(PC6) U21.15(PC5) U21.16(PC4) U21.23(PA6) U21.24(PA7) U21.32(PG5) U21.33(PG4) U21.34(PG3) U21.35(PG2) U21.36(PG1) U21.37(PG0) U21.43(PD4) U21.44(PD5) U21.45(PB0) U21.46(PB1) U21.59(PE4) U21.60(PE5) U21.61(PD0) U21.62(PD1) U21.63(PD2) U21.64(PD3) X8.7

### Notes on the sheet
- MCU General + CC1200 (Primary)
- UART Console Port
- CAN transceiver
- Note: 868 - 915 MHz
- I2C Port

## Sheet 8 of 10: RF MUX + Antenna
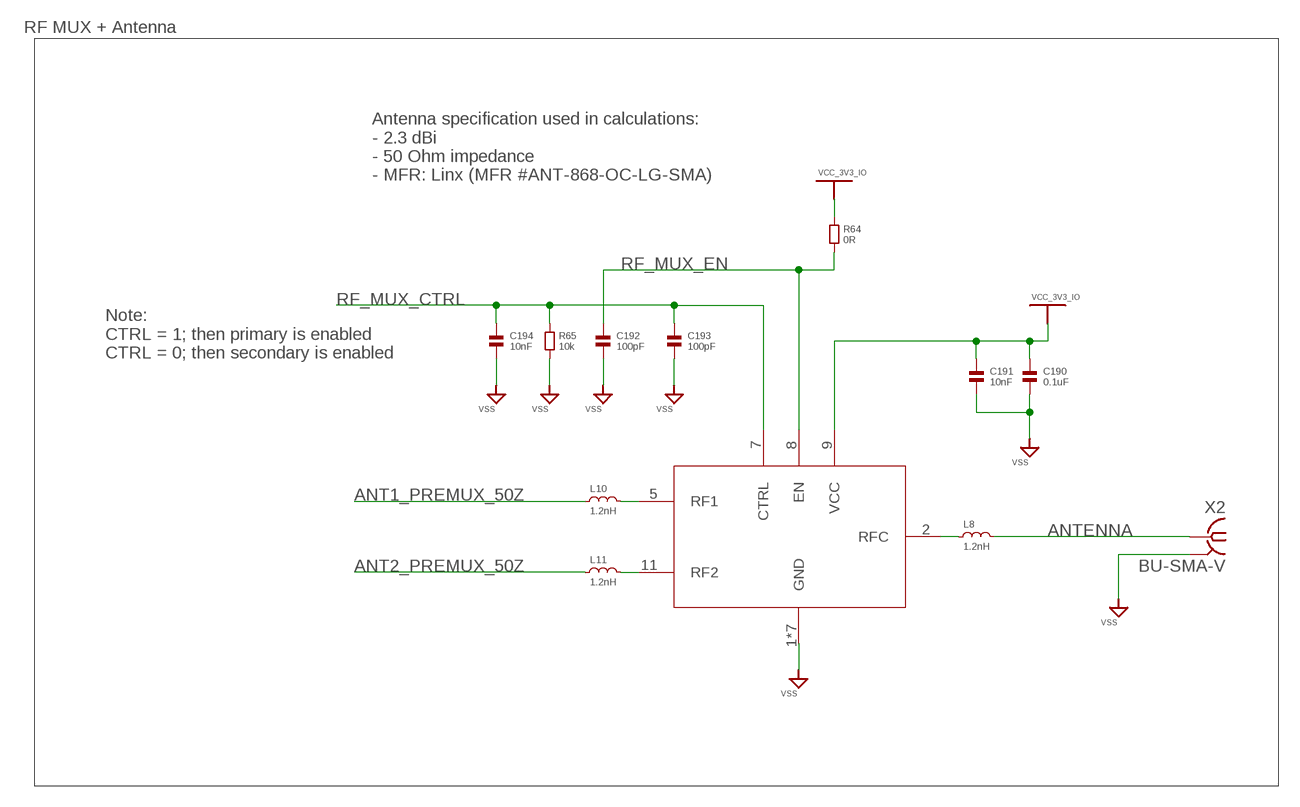
[diagram p10: schematic, sheet 8]

### Parts
C190  0.1uF  CAPACITOR.0603  [0603]
C191  10nF  CAPACITOR.0603  [0603]
C192  100pF  CAPACITOR.0603  [0603]
C193  100pF  CAPACITOR.0603  [0603]
C194  10nF  CAPACITOR.0603  [0603]
L8  1.2nH  RF-INDUCTOR.0402  [0402]
L10  1.2nH  RF-INDUCTOR.0402  [0402]
L11  1.2nH  RF-INDUCTOR.0402  [0402]
R64  0R  RESISTOR.0603  [0603]
R65  10k  RESISTOR.0603  [0603]
U17  QORVO-RF_SWITCH-QPC7512  [QORVO-RF_SWITCH-QPC7512]
X2  BU-SMA-V  [BU-SMA-V]

### Nets
ANT1_PREMUX_50Z: L10.1 ; also sheet 6
ANT2_PREMUX_50Z: L11.1 ; also sheet 7
ANTENNA: L8.2 X2.1
N$40: L8.1 U17.2(RFC)
N$41: L11.2 U17.11(RF2)
N$42: L10.2 U17.5(RF1)
RF_MUX_CTRL: C193.1 C194.1 R65.1 U17.7(CTRL) ; also sheet 4
RF_MUX_EN: C192.1 R64.2 U17.8(EN)
VCC_3V3_IO: C190.1 C191.1 R64.1 U17.9(VCC) ; also sheet 1,2,3,4,5,6,7,9,10
VSS: C190.2 C191.2 C192.2 C193.2 C194.2 R65.2 U17.1(GND) U17.3(GND) U17.4(GND) U17.6(GND) U17.10(GND) U17.12(GND) U17.13(GND) X2.2 X2.3 X2.4 X2.5 ; also sheet 1,2,3,4,5,6,7,9,10

### Notes on the sheet
- RF MUX + Antenna
- Antenna specification used in calculations:
  - 2.3 dBi
  - 50 Ohm impedance
  - MFR: Linx (MFR #ANT-868-OC-LG-SMA)
- Note:
  CTRL = 1; then primary is enabled
  CTRL = 0; then secondary is enabled

## Sheet 9 of 10: Regulator General
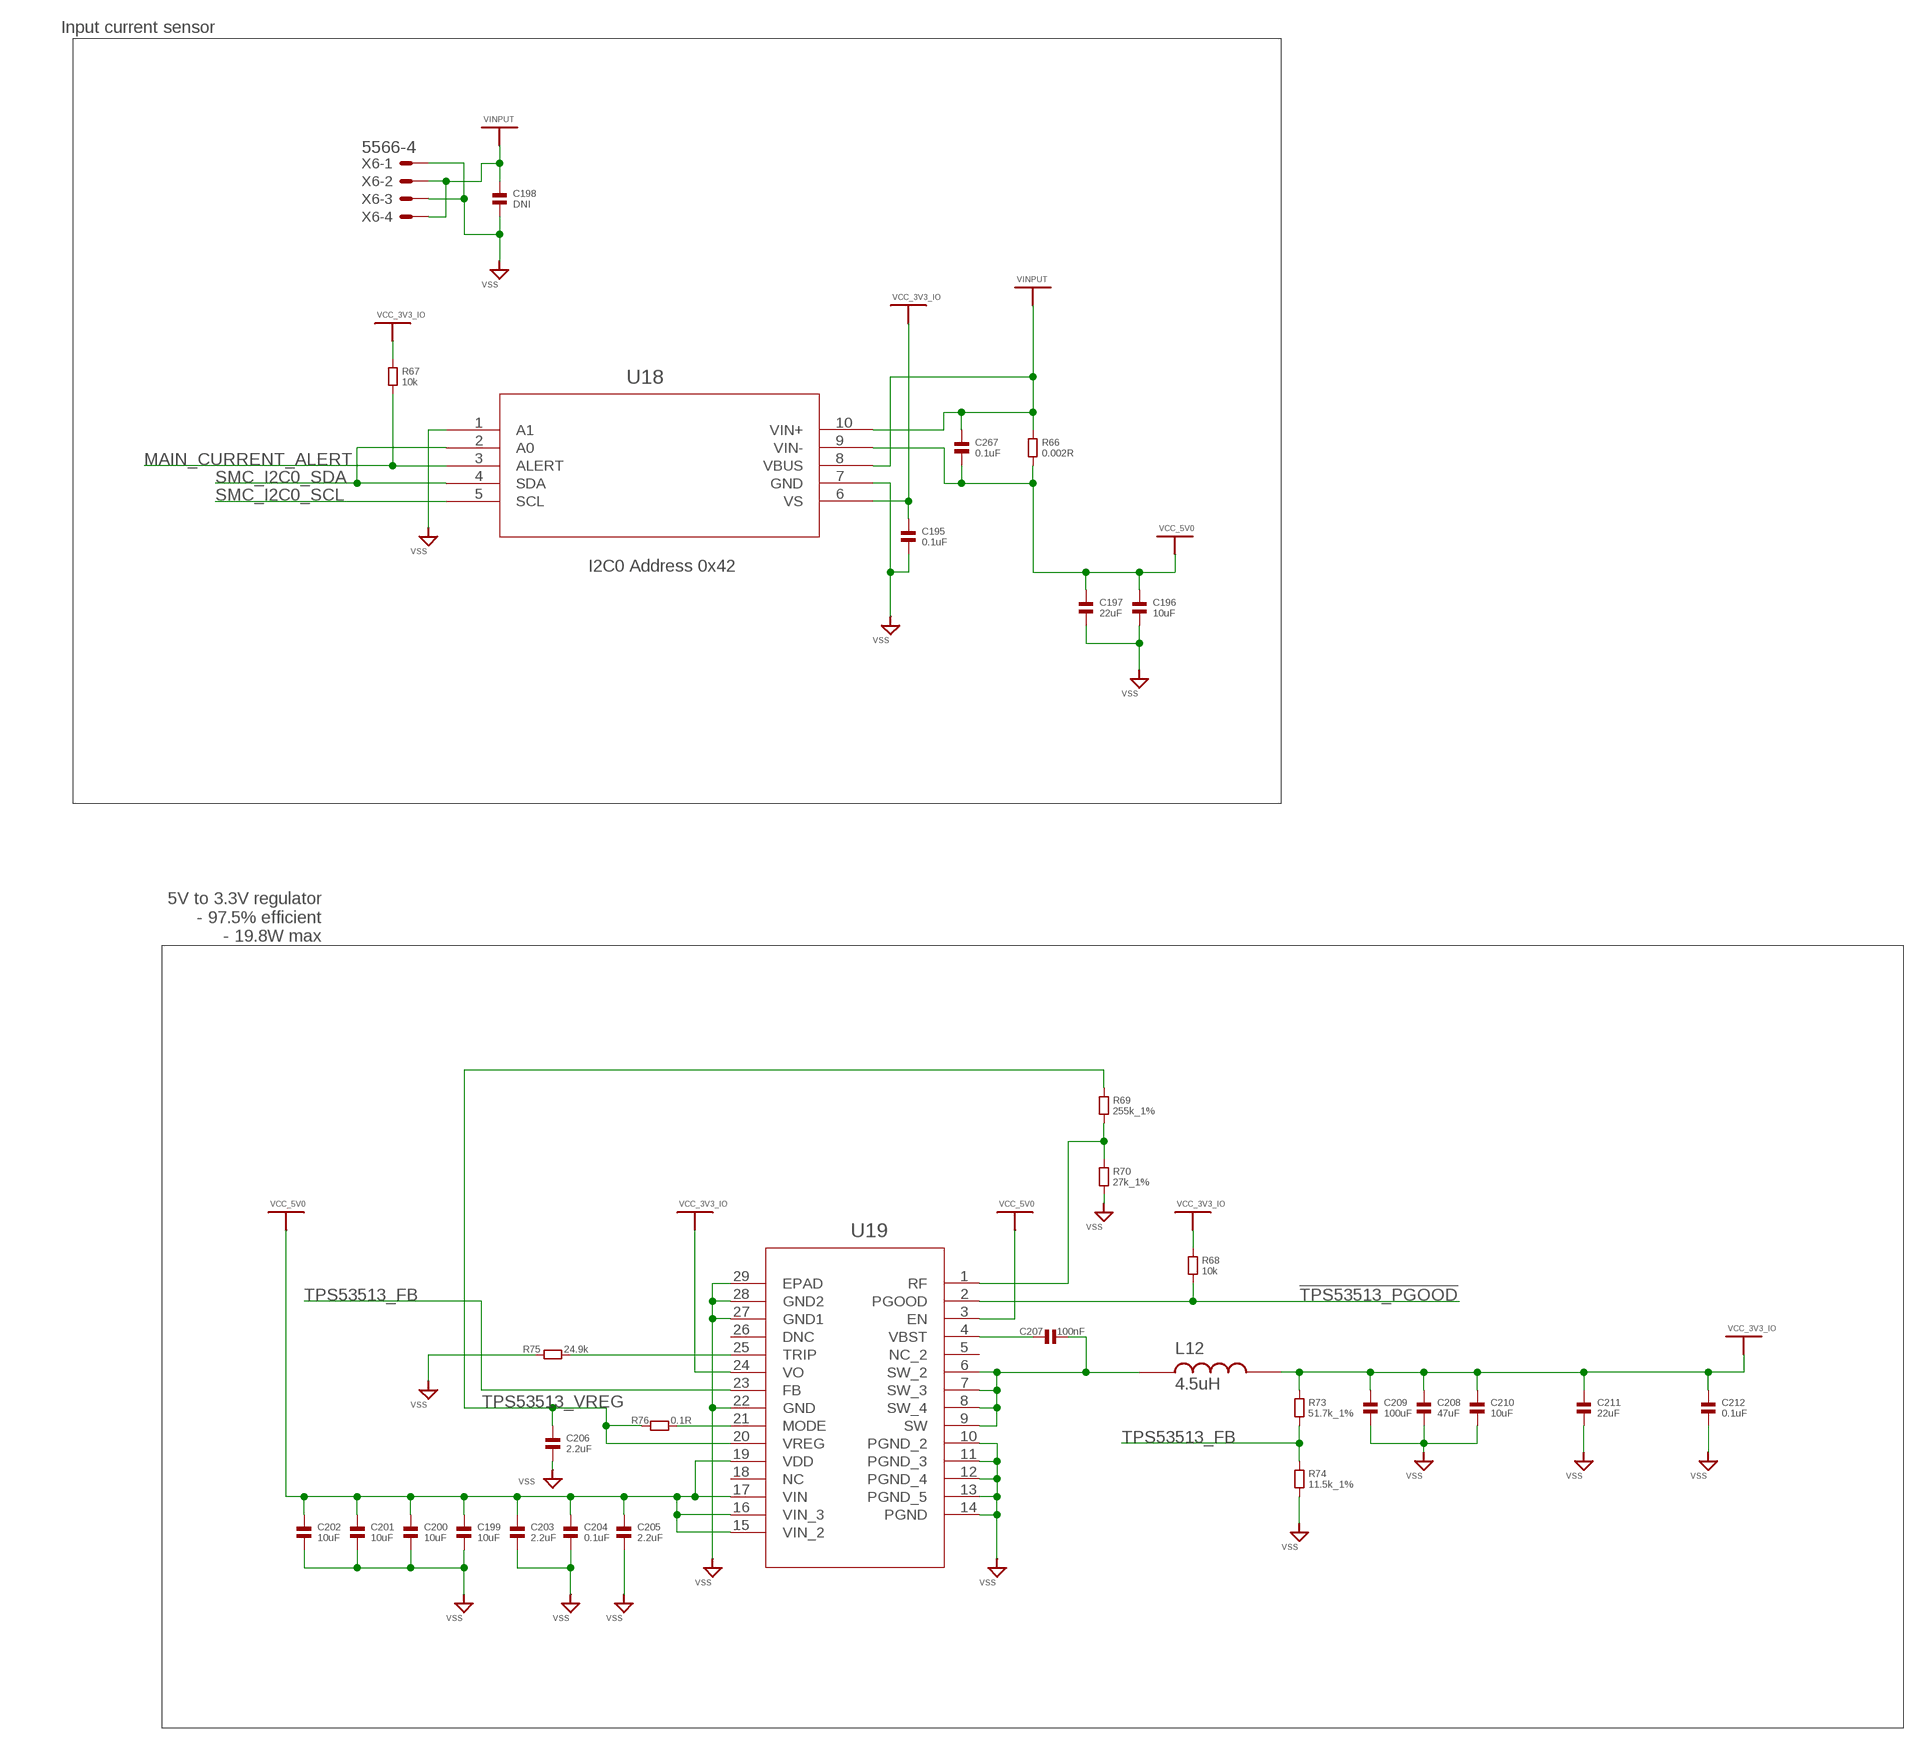
[diagram p11: schematic, sheet 9]

### Parts
C195  0.1uF  CAPACITOR.0603  [0603]
C196  10uF  CAPACITOR.0805  [0805]
C197  22uF  CAPACITOR.0805  [0805]
C198  DNI  CAPACITOR.0805  [0805]
C199  10uF  CAPACITOR.0805  [0805]
C200  10uF  CAPACITOR.0805  [0805]
C201  10uF  CAPACITOR.0805  [0805]
C202  10uF  CAPACITOR.0805  [0805]
C203  2.2uF  CAPACITOR.0603  [0603]
C204  0.1uF  CAPACITOR.0603  [0603]
C205  2.2uF  CAPACITOR.0603  [0603]
C206  2.2uF  CAPACITOR.0603  [0603]
C207  100nF  CAPACITOR.0805  [0805]
C208  47uF  CAPACITOR.1206  [1206]
C209  100uF  CAPACITOR.1206  [1206]
C210  10uF  CAPACITOR.0805  [0805]
C211  22uF  CAPACITOR.0805  [0805]
C212  0.1uF  CAPACITOR.0805  [0805]
C267  0.1uF  CAPACITOR.0603  [0603]
L12  4.5uH  BOURNS-INDUCTOR-SRR1208-4R5ML  [BOURNS-INDUCTOR-SRR1208-4R5ML]
R66  0.002R  RESISTOR.1812  [1812]
R67  10k  RESISTOR.0603  [0603]
R68  10k  RESISTOR.0603  [0603]
R69  255k_1%  RESISTOR.0603  [0603]
R70  27k_1%  RESISTOR.0603  [0603]
R73  51.7k_1%  RESISTOR.0603  [0603]
R74  11.5k_1%  RESISTOR.0603  [0603]
R75  24.9k  RESISTOR.0603  [0603]
R76  0.1R  RESISTOR.0603  [0603]
U18  TEXAS_INSTRUMENTS-CURRENT_MONITOR-INA226_DGS_10  [TEXAS_INSTRUMENTS-CURRENT_MONITOR-INA226_DGS_10]
U19  TEXAS_INSTRUMENTS-BUCK_CONVERTER-TPS53513RVER  [RVE28_TEX]
X6  5566-4  [5566-4]

### Nets
!TPS53513_PGOOD: R68.2 U19.2(PGOOD) ; also sheet 1,4
MAIN_CURRENT_ALERT: R67.2 U18.3(ALERT) ; also sheet 1
N$43: R69.2 R70.1 U19.1(RF)
N$46: C207.1 U19.4(VBST)
N$47: C207.2 L12.1 U19.6(SW_2) U19.7(SW_3) U19.8(SW_4) U19.9(SW)
N$48: R75.2 U19.25(TRIP)
N$49: R76.2 U19.21(MODE)
SMC_I2C0_SCL: U18.5(SCL) ; also sheet 1,3,5,10
SMC_I2C0_SDA: U18.2(A0) U18.4(SDA) ; also sheet 1,3,5,10
TPS53513_FB: R73.2 R74.1 U19.23(FB)
TPS53513_VREG: C206.1 R69.1 R76.1 U19.20(VREG)
VCC_3V3_IO: C195.1 C208.1 C209.1 C210.1 C211.1 C212.1 L12.2 R67.1 R68.1 R73.1 U18.6(VS) U19.24(VO) ; also sheet 1,2,3,4,5,6,7,8,10
VCC_5V0: C196.1 C197.1 C199.1 C200.1 C201.1 C202.1 C203.1 C204.1 C205.1 C267.2 R66.2 U18.9(VIN-) U19.3(EN) U19.15(VIN_2) U19.16(VIN_3) U19.17(VIN) U19.19(VDD) ; also sheet 1,3,6,7,10
VINPUT: C198.1 C267.1 R66.1 U18.8(VBUS) U18.10(VIN+) X6.2 X6.4
VSS: C195.2 C196.2 C197.2 C198.2 C199.2 C200.2 C201.2 C202.2 C203.2 C204.2 C205.2 C206.2 C208.2 C209.2 C210.2 C211.2 C212.2 R70.2 R74.2 R75.1 U18.1(A1) U18.7(GND) U19.10(PGND_2) U19.11(PGND_3) U19.12(PGND_4) U19.13(PGND_5) U19.14(PGND) U19.22(GND) U19.27(GND1) U19.28(GND2) U19.29(EPAD) X6.1 X6.3 ; also sheet 1,2,3,4,5,6,7,8,10
Unconnected: U19.5(NC_2) U19.18(NC) U19.26(DNC)

### Notes on the sheet
- Input current sensor
- I2C0 Address 0x42
- 5V to 3.3V regulator
  - 97.5% efficient
  - 19.8W max

## Sheet 10 of 10: Application Baseboard Connector
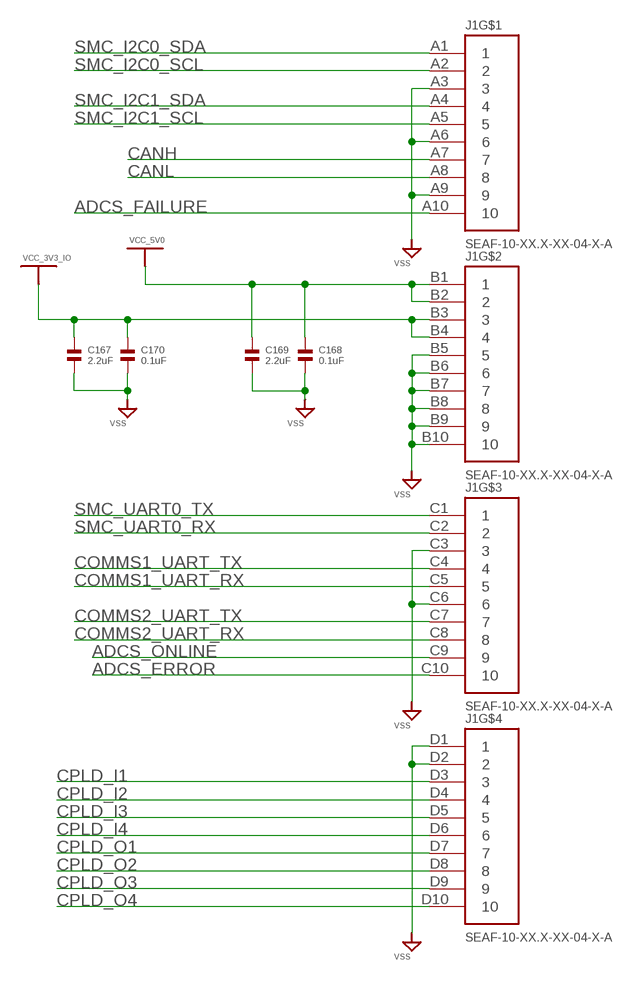
[diagram p12: schematic, sheet 10]

### Parts
C167  2.2uF  CAPACITOR.0603  [0603]
C168  0.1uF  CAPACITOR.0603  [0603]
C169  2.2uF  CAPACITOR.0603  [0603]
C170  0.1uF  CAPACITOR.0603  [0603]
J1  SEAF-10-XX.X-XX-04-X-A  [SEAF-10-XX.X-XX-04-X-A]

### Nets
ADCS_ERROR: J1.C10 ; also sheet 4
ADCS_FAILURE: J1.A10
ADCS_ONLINE: J1.C9 ; also sheet 4
CANH: J1.A7 ; also sheet 1,6,7
CANL: J1.A8 ; also sheet 1,6,7
COMMS1_UART_RX: J1.C5 ; also sheet 6
COMMS1_UART_TX: J1.C4 ; also sheet 6
COMMS2_UART_RX: J1.C8 ; also sheet 7
COMMS2_UART_TX: J1.C7 ; also sheet 7
CPLD_I1: J1.D3 ; also sheet 4
CPLD_I2: J1.D4 ; also sheet 4
CPLD_I3: J1.D5 ; also sheet 4
CPLD_I4: J1.D6 ; also sheet 4
CPLD_O1: J1.D7 ; also sheet 4
CPLD_O2: J1.D8 ; also sheet 4
CPLD_O3: J1.D9 ; also sheet 4
CPLD_O4: J1.D10 ; also sheet 4
SMC_I2C0_SCL: J1.A2 ; also sheet 1,3,5,9
SMC_I2C0_SDA: J1.A1 ; also sheet 1,3,5,9
SMC_I2C1_SCL: J1.A5 ; also sheet 1
SMC_I2C1_SDA: J1.A4 ; also sheet 1
SMC_UART0_RX: J1.C2 ; also sheet 1
SMC_UART0_TX: J1.C1 ; also sheet 1
VCC_3V3_IO: C167.1 C170.1 J1.B3 J1.B4 ; also sheet 1,2,3,4,5,6,7,8,9
VCC_5V0: C168.1 C169.1 J1.B1 J1.B2 ; also sheet 1,3,6,7,9
VSS: C167.2 C168.2 C169.2 C170.2 J1.A3 J1.A6 J1.A9 J1.B5 J1.B6 J1.B7 J1.B8 J1.B9 J1.B10 J1.C3 J1.C6 J1.D1 J1.D2 ; also sheet 1,2,3,4,5,6,7,8,9

## Library data of the parts
C1-C269 = standardparts:CAPACITOR
IC1 = SamacSys_Parts:XC9572XL-10VQG44C: XILINX - XC9572XL-10VQG44C - CPLD, 72 MACROCELL, 3.3V, 44VQFP Source: Datasheet <https://componentsearchengine.com/Datasheets/2/XC9572XL-10VQG44C.pdf>; DESCRIPTION: XILINX - XC9572XL-10VQG44C - CPLD, 72 MACROCELL, 3.3V, 44VQFP; HEIGHT: 1.2mm; MANUFACTURER_NAME: XILINX; MANUFACTURER_PART_NUMBER: XC9572XL-10VQG44C
J1 = SEAF-10-XX.X-XX-04-X-A:SEAF-10-XX.X-XX-04-X-A: .050 PITCH SOCKET ARRAY ASSEMBLY.; AVAILABILITY: Unavailable; DESCRIPTION: .050 SEARAY™ High-Speed High-Density Open-Pin-Field Array Socket 10 positions; MF: Samtec; MP: SEAF-10-XX.X-XX-04-X-A; PACKAGE: None; PRICE: None
JP1 JP4 = pinhead:PINHD-1X8: PIN HEADER
JP2 JP3 JP9-JP11 = pinhead:PINHD-1X4: PIN HEADER
JP5-JP8 = pinhead:PINHD-1X2: PIN HEADER
L1-L11 L13-L20 = standardparts:RF-INDUCTOR
L12 = Module_Inductors:BOURNS-INDUCTOR-SRR1208-4R5ML
R1-R96 = standardparts:RESISTOR
U1 U20 = Module_ICs:TEXAS_INSTRUMENTS-RADAR-CC1200RHBR; ALTERNATEPARTNUMBER: CC1200RHBT; APPLICATION_BUILDNUMBER: *; COMPTYPE: IC; MANUFACTURER: Texas Instruments; MOUNTTYPE: SMT; PACKAGEREFERENCE: RHB0032E; PARTNUMBER: CC1200RHBR; PIN_COUNT: 33; REFDES: RefDes; ROHS: Y; TYPE: TYPE
U2 = Module_ICs:TEXAS_INSTRUMENTS-MICROCONTROLLER-TMS320F28386DZWTQ; MANUFACTURER: Texas Instruments; PARTNUMBER: F28386DZWTSR; REFDES: RefDes; TYPE: TYPE
U3 U21 = Module_ICs:TEXAS_INSTRUMENTS-MICROCONTROLLER-TM4C1230D5PMI7R; ALTERNATE_PARTNUMBER: TM4C1230D5PMI; APPLICATION_BUILDNUMBER: *; COMPTYPE: IC; MANUFACTURER: Texas Instruments; MOUNTTYPE: SMT; PACKAGEREFERENCE: PM0064A; PARTNUMBER: TM4C1230D5PMIR; PIN_COUNT: 64; REFDES: RefDes; ROHS: Y; TYPE: TYPE
U4 U14 U22 = Module_ICs:TEXAS_INSTRUMENTS-CAN_TRANSCEIVER-TCAN1042VDRQ1; MANUFACTURER: Texas Instruments; PARTNUMBER: TCAN1042VDRQ1; REFDES: RefDes; TYPE: TYPE
U5 U23 = Module_Gates:TEXAS_INSTRUMENTS-AND_GATE-SN74LVC1G11_DCK_6; DATASHEETURL: httpwww.ti.comlitgpnSN74LVC1G11; FAMILY_NAME: LL AND GATE; GENERIC_PART_NUMBER: SN74LVC1G11; INDUSTRY_STD_PKG_TYPE: SC70; MANUFACTURER: Texas Instruments; MANUFACTURER_PART_NUMBER: sn74lvc1g11_dck_6; PACKAGE_DESIGNATOR: DCK; PIN_COUNT: 6; VENDOR: Texas Instruments
U6 = Module_ICs:ISSI-DRAM-IS42S16320F-7TL
U7 U34 = tmp10x:TMP100: Digital Temperature sensor from Texas Instruments Digital output : I2C Resolution : 9 to 12bit Accuracy : 2'C from -25'C to 85'C ; 3'C from -55'C to 125'C Supply : 2,7 to 5,5V / 45uA (standby 0,1uA)
U8 U9 = BMX160:BMX160: IMU ACCEL/GYRO/MAG; AVAILABILITY: Unavailable; DESCRIPTION: IMU ACCEL/GYRO/MAG; MF: Bosch Sensortec; MP: BMX160; PACKAGE: VFLGA-14 Bosch Sensortec; PRICE: None
U10 U11 = Module_ICs:TEXAS_INSTRUMENTS-MOTOR_PWM_DRIVER-DRV8833CPWP; MANUFACTURER: Texas Instruments; PARTNUMBER: DRV8833CPWPR; REFDES: RefDes; TYPE: TYPE
U12 U13 U18 = Module_Regulators:TEXAS_INSTRUMENTS-CURRENT_MONITOR-INA226_DGS_10; DATASHEETURL: httpwww.ti.comlitgpnINA226; FAMILY_NAME: CURRENT SHUNT MONITOR; GENERIC_PART_NUMBER: INA226; INDUSTRY_STD_PKG_TYPE: MSOP; MANUFACTURER: Texas Instruments; MANUFACTURER_PART_NUMBER: ina226_dgs_10; PACKAGE_DESIGNATOR: DGS; PIN_COUNT: 10; VENDOR: Texas Instruments
U15 U16 U24 = Module_ICs:KIOXIA_AMERICA-NAND_FLASH-TC58CVG0S3HRAIG
U17 = Module_ICs:QORVO-RF_SWITCH-QPC7512
U19 = Module_Regulators:TEXAS_INSTRUMENTS-BUCK_CONVERTER-TPS53513RVER; BUILT_BY: EMA_Molly; COPYRIGHT: Copyright (C) 2018 Accelerated Designs. All rights reserved; MANUFACTURER_PART_NUMBER: TPS53513RVER; SOURCELIBRARY: TI_2019-05-24; VENDOR: Texas Instruments
X1 X7 = Module_ICs:ECS_INC-OSCILLATOR-ECS-400-10-37-CKM-TR
X2 = con-coax:BU-SMA-V: FEMALE SMA CONNECTOR Radiall distributor RS 112-3794; OC_FARNELL: unknown; OC_NEWARK: unknown
X3-X5 X8 = con-3m:2510-: 3M (TM) Pak 100 4-Wall Header Source: 3M; MF: 3M; MPN: 2510-6002UB; OC_FARNELL: 9838244; OC_NEWARK: 46F4725
X6 = con-molex:5566-4: Mini FIT connector 4 pol Source: http://www.molex.com; MF: MOLEX; OC_FARNELL: unknown; OC_NEWARK: unknown
Y1-Y3 = Module_ICs:ESC-OSCILLATOR-ECS_200_9_33B_CTP_TR